# EAGLE design motherboard_rev0 (EAGLE 6.5.0)
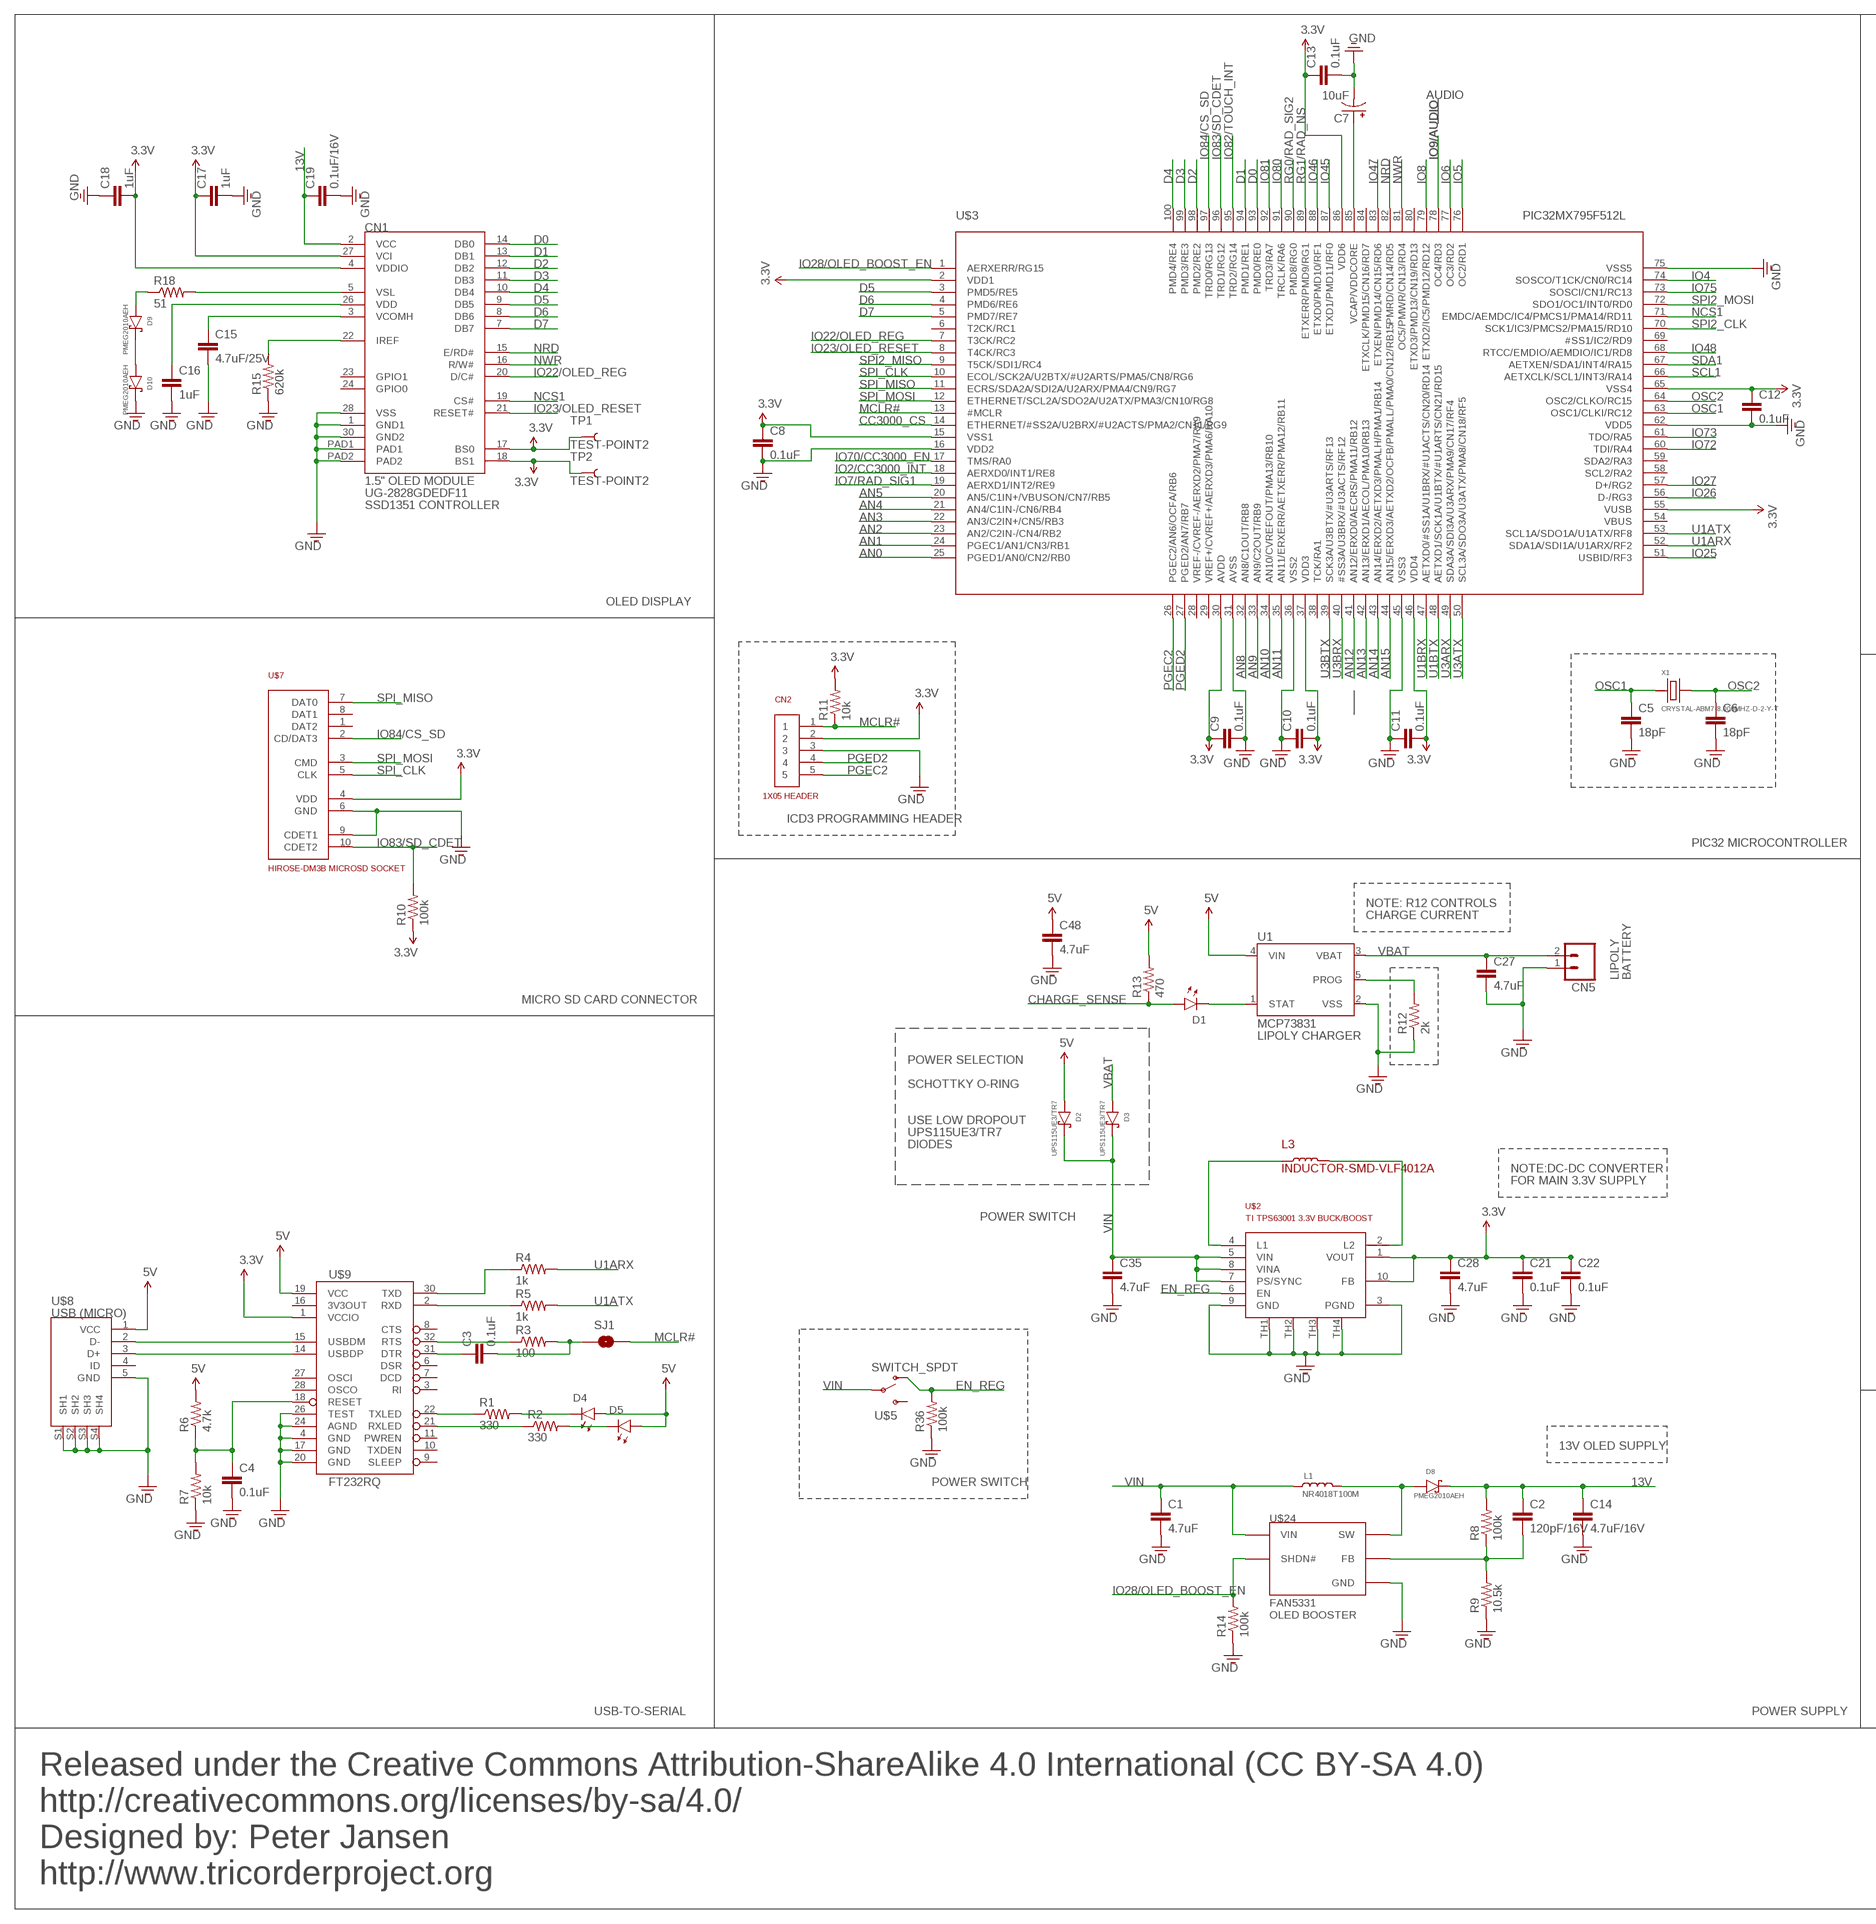
[diagram p0: schematic, sheet 1, part 1 of 2]
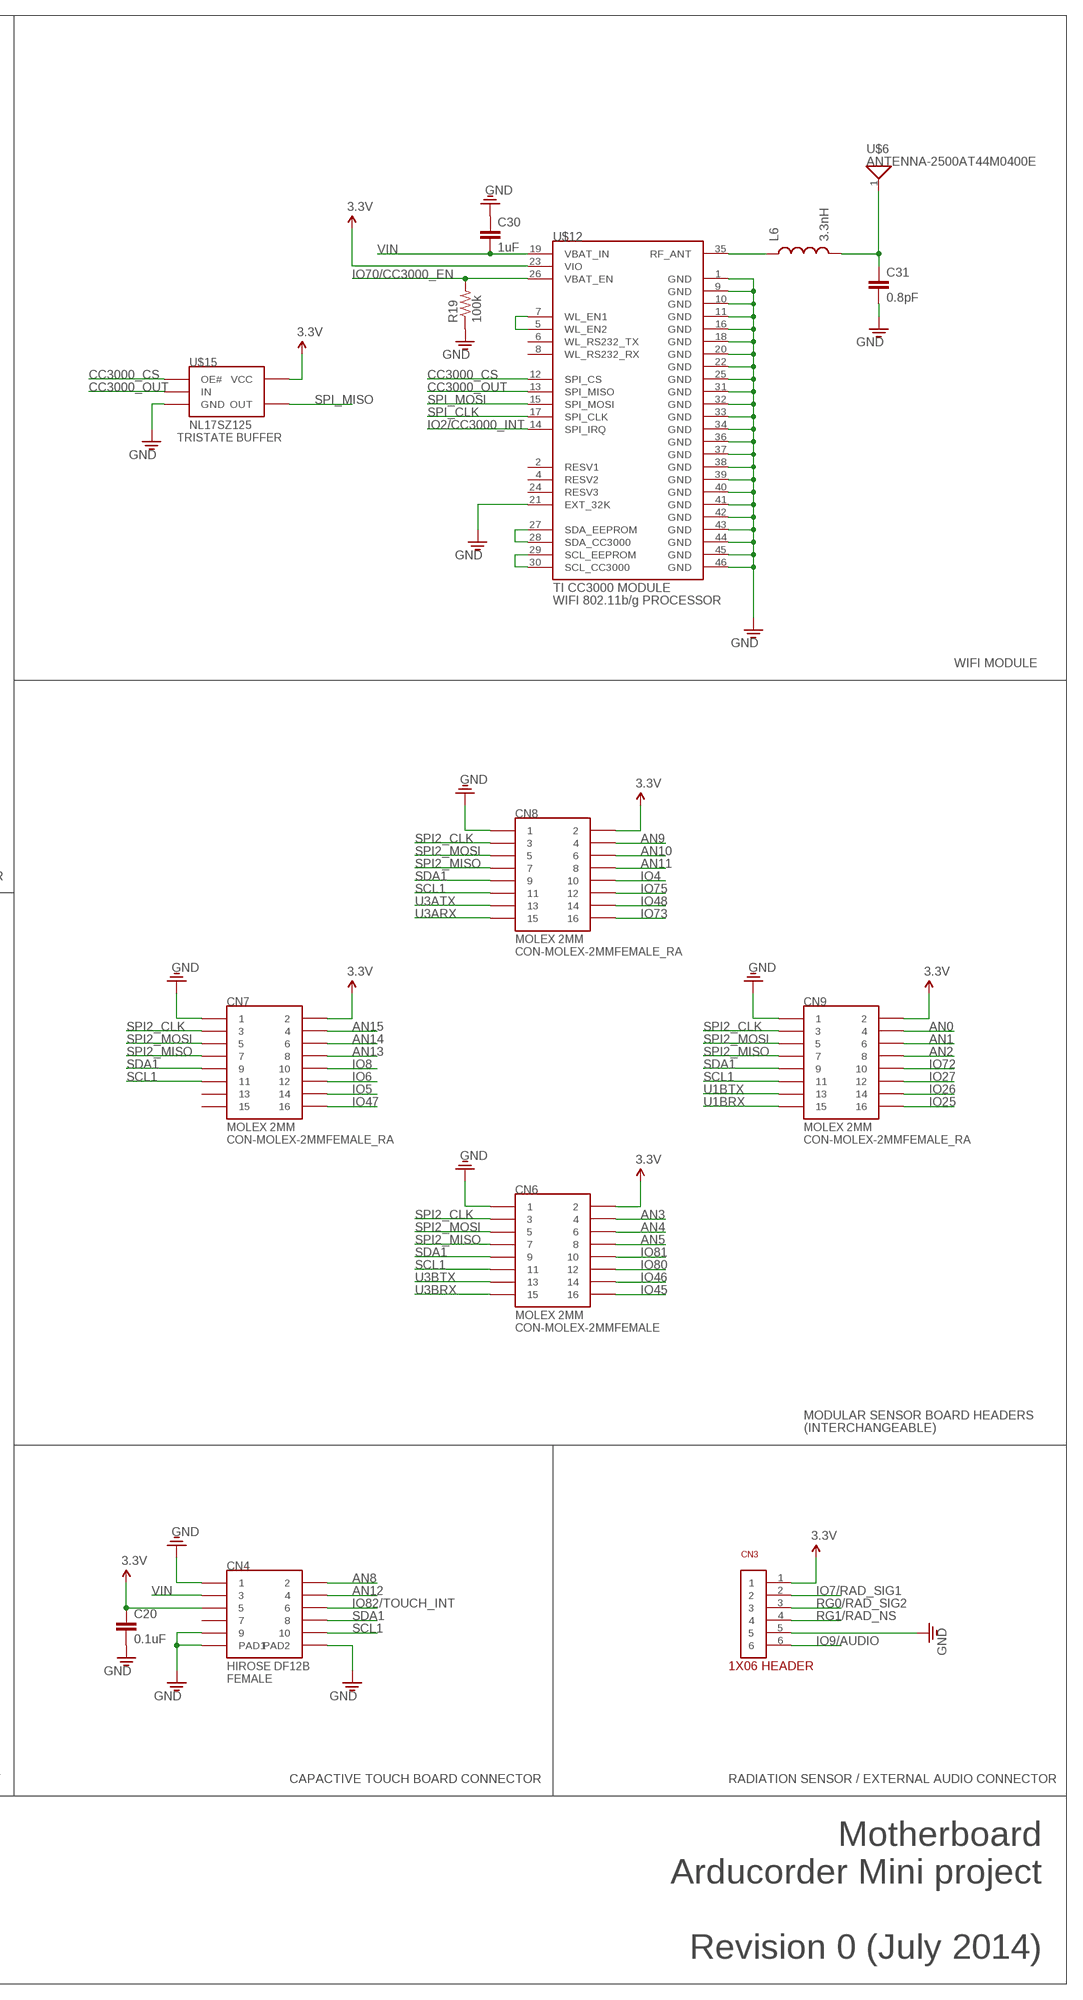
[diagram p1: schematic, sheet 1, part 2 of 2]

## Parts
C1  4.7uF  CAP0603  [0603]
C2  120pF/16V  CAP0603  [0603]
C3  0.1uF  CAP0603  [0603]
C4  0.1uF  CAP0603  [0603]
C5  18pF  CAP0603  [0603]
C6  18pF  CAP0603  [0603]
C7  10uF  CAP_POL1206  [EIA3216]
C8  0.1uF  CAP0603  [0603]
C9  0.1uF  CAP0603  [0603]
C10  0.1uF  CAP0603  [0603]
C11  0.1uF  CAP0603  [0603]
C12  0.1uF  CAP0603  [0603]
C13  0.1uF  CAP0603  [0603]
C14  4.7uF/16V  CAP0603  [0603]
C15  4.7uF/25V  CAP0603  [0603]
C16  1uF  CAP0603  [0603]
C17  1uF  CAP0603  [0603]
C18  1uF  CAP0603  [0603]
C19  0.1uF/16V  CAP0603  [0603]
C20  0.1uF  CAP0603  [0603]
C21  0.1uF  CAP0603  [0603]
C22  0.1uF  CAP0603  [0603]
C27  4.7uF  CAP0603  [0603]
C28  4.7uF  CAP0603  [0603]
C30  1uF  CAP0603  [0603]
C31  0.8pF  CAP0402  [C0402]
C35  4.7uF  CAP0603  [0603]
C48  4.7uF  CAP0603  [0603]
CN1  UG-2828GDEDF11-1.5OLED  [XF2M-3015-1A-1.5LCD]
CN2  1X05  [1X05]
CN3  1X06  [1X06]
CN4  FEMALE  CON-HIROSE-DF12FEMALE  [DF12B(3.0)-10DP-0.5V(86)]
CN5  M02-JST-2MM-SMT  [JST-2-SMD]
CN6  CON-MOLEX-2MMFEMALE  [MOLEX-0791091007]
CN7  CON-MOLEX-2MMFEMALE_RA  [MOLEX-87368-1624]
CN8  CON-MOLEX-2MMFEMALE_RA  [MOLEX-87368-1624]
CN9  CON-MOLEX-2MMFEMALE_RA  [MOLEX-87368-1624]
D1  0605-LED  [0603-LED]
D2  UPS115UE3/TR7  DIODE-SCHOTTKY  [DO-214BA]
D3  UPS115UE3/TR7  DIODE-SCHOTTKY  [DO-214BA]
D4  0605-LED  [0603-LED]
D5  0605-LED  [0603-LED]
D8  PMEG2010AEH  DIODE-SCHOTTKYSOD123F  [SOD123F]
D9  PMEG2010AEH  DIODE-SCHOTTKYSOD123F  [SOD123F]
D10  PMEG2010AEH  DIODE-SCHOTTKYSOD123F  [SOD123F]
L1  NR4018T100M  INDUCTORNR4018T100M  [NR4018T100M]
L3  INDUCTOR-SMD-VLF4012A  [VLF4012A]
L6  3.3nH  INDUCTOR0402  [C0402]
R1  330  RESISTOR0603  [0603]
R2  330  RESISTOR0603  [0603]
R3  100  RESISTOR0603  [0603]
R4  1k  RESISTOR0603  [0603]
R5  1k  RESISTOR0603  [0603]
R6  4.7k  RESISTOR0603  [0603]
R7  10k  RESISTOR0603  [0603]
R8  100k  RESISTOR0603  [0603]
R9  10.5k  RESISTOR0603  [0603]
R10  100k  RESISTOR0603  [0603]
R11  10k  RESISTOR0603  [0603]
R12  2k  RESISTOR0603  [0603]
R13  470  RESISTOR0603  [0603]
R14  100k  RESISTOR0603  [0603]
R15  620k  RESISTOR0603  [0603]
R18  51  RESISTOR0603  [0603]
R19  100k  RESISTOR0603  [0603]
R36  100k  RESISTOR0603  [0603]
SJ1  SOLDERJUMPERTRACE  [SJ_2S-TRACE]
TP1  TEST-POINT2  [PAD.02X.02]
TP2  TEST-POINT2  [PAD.02X.02]
U1  MCP73831  [SOT23-5]
U$2  TI-TPS63001-3.3V-BUCKBOOST  [TPS63001]
U$3  PIC32MX795F512L-80I/PF  [SQFP-S-14X14-100]
U$5  SWITCH_SPDT  [KPS-1290]
U$6  ANTENNA-2500AT44M0400E  [ANT-2500AT44M0400E]
U$7  CON-HIROSE-DM3B-MICROSD  [CON-HIROSE-DM3B-MICROSD]
U$8  USB-MICROB  [FCI-10104110-0001LF]
U$9  FT232RQ  [QFN-32]
U$12  CC3000  [CC3000]
U$15  BUFFER-NL17SZ125  [TSOP-5]
U$24  FAN5331-BOOST  [TSOP-5]
X1  CRYSTAL-ABM7-8.000MHZ-D-2-Y-T  [CYRSTAL-6.0X3.5MM]

## Nets
3.3V: C8.1 C9.1 C10.2 C11.2 C12.1 C13.1 C17.1 C18.2 C20.1 C21.1 C22.1 C28.1 CN1.4(VDDIO) CN1.17(BS0) CN1.18(BS1) CN1.27(VCI) CN2.2 CN3.1 CN4.5 CN6.2 CN7.2 CN8.2 CN9.2 R10.1 R11.2 TP1.P$1 TP2.P$1 U$2.1(VOUT) U$2.10(FB) U$3.2(VDD1) U$3.15(VSS1) U$3.30(AVDD) U$3.37(VDD3) U$3.46(VDD4) U$3.55(VUSB) U$3.65(VSS4) U$3.86(VDD6) U$7.4(VDD) U$9.1(VCCIO) U$12.23(VIO) U$15.5(VCC)
5V: C48.1 D2.ANODE D4.ANODE D5.ANODE R6.2 R13.2 U1.4(VIN) U$8.1(VCC) U$9.19(VCC)
13V: C2.1 C14.1 C19.1 CN1.2(VCC) D8.1(CATHODE) R8.2
AN0: CN9.4 U$3.25(PGED1/AN0/CN2/RB0)
AN1: CN9.6 U$3.24(PGEC1/AN1/CN3/RB1)
AN2: CN9.8 U$3.23(AN2/C2IN-/CN4/RB2)
AN3: CN6.4 U$3.22(AN3/C2IN+/CN5/RB3)
AN4: CN6.6 U$3.21(AN4/C1IN-/CN6/RB4)
AN5: CN6.8 U$3.20(AN5/C1IN+/VBUSON/CN7/RB5)
AN8: CN4.2 U$3.32(AN8/C1OUT/RB8)
AN9: CN8.4 U$3.33(AN9/C2OUT/RB9)
AN10: CN8.6 U$3.34(AN10/CVREFOUT/PMA13/RB10)
AN11: CN8.8 U$3.35(AN11/ERXERR/AETXERR/PMA12/RB11)
AN12: CN4.4 U$3.41(AN12/ERXD0/AECRS/PMA11/RB12)
AN13: CN7.8 U$3.42(AN13/ERXD1/AECOL/PMA10/RB13)
AN14: CN7.6 U$3.43(AN14/ERXD2/AETXD3/PMALH/PMA1/RB14)
AN15: CN7.4 U$3.44(AN15/ERXD3/AETXD2/OCFB/PMALL/PMA0/CN12/RB15)
CC3000_CS: U$3.14(ETHERNET/#SS2A/U2BRX/#U2ACTS/PMA2/CN11/RG9) U$12.12(SPI_CS) U$15.1(OE#)
CC3000_OUT: U$12.13(SPI_MISO) U$15.2(IN)
CHARGE_SENSE: D1.ANODE R13.1
D0: CN1.14(DB0) U$3.93(PMD0/RE0)
D1: CN1.13(DB1) U$3.94(PMD1/RE1)
D2: CN1.12(DB2) U$3.98(PMD2/RE2)
D3: CN1.11(DB3) U$3.99(PMD3/RE3)
D4: CN1.10(DB4) U$3.100(PMD4/RE4)
D5: CN1.9(DB5) U$3.3(PMD5/RE5)
D6: CN1.8(DB6) U$3.4(PMD6/RE6)
D7: CN1.7(DB7) U$3.5(PMD7/RE7)
EN_REG: R36.2 U$2.6(EN) U$5.O
GND: C1.2 C4.2 C5.2 C6.2 C7.C(-) C8.2 C9.2 C10.1 C11.1 C12.2 C13.2 C14.2 C15.2 C16.2 C17.2 C18.1 C19.2 C20.2 C21.2 C22.2 C27.2 C28.2 C30.1 C31.2 C35.2 C48.2 CN1.1(GND1) CN1.28(VSS) CN1.30(GND2) CN1.PAD1 CN1.PAD2 CN2.3 CN3.5 CN4.1 CN4.9 CN4.PAD1 CN4.PAD2 CN5.1 CN6.1 CN7.1 CN8.1 CN9.1 D10.1(CATHODE) R7.1 R9.1 R12.1 R14.1 R15.1 R19.1 R36.1 U1.2(VSS) U$2.3(PGND) U$2.9(GND) U$2.TH1(THERM1) U$2.TH2(THERM2) U$2.TH3(THERM3) U$2.TH4(THERM4) U$3.16(VDD2) U$3.31(AVSS) U$3.36(VSS2) U$3.45(VSS3) U$3.62(VDD5) U$3.75(VSS5) U$7.6(GND) U$7.9(CDET1) U$8.5(GND) U$8.S1(SH1) U$8.S2(SH2) U$8.S3(SH3) U$8.S4(SH4) U$9.4(GND) U$9.17(GND) U$9.20(GND) U$9.24(AGND) U$9.26(TEST) U$12.1(GND) U$12.9(GND) U$12.10(GND) U$12.11(GND) U$12.16(GND) U$12.18(GND) U$12.20(GND) U$12.21(EXT_32K) U$12.22(GND) U$12.25(GND) U$12.31(GND) U$12.32(GND) U$12.33(GND) U$12.34(GND) U$12.36(GND) U$12.37(GND) U$12.38(GND) U$12.39(GND) U$12.40(GND) U$12.41(GND) U$12.42(GND) U$12.43(GND) U$12.44(GND) U$12.45(GND) U$12.46(GND) U$15.3(GND) U$24.2(GND)
IO2/CC3000_INT: U$3.18(AERXD0/INT1/RE8) U$12.14(SPI_IRQ)
IO4: CN8.10 U$3.74(SOSCO/T1CK/CN0/RC14)
IO5: CN7.14 U$3.76(OC2/RD1)
IO6: CN7.12 U$3.77(OC3/RD2)
IO7/RAD_SIG1: CN3.2 U$3.19(AERXD1/INT2/RE9)
IO8: CN7.10 U$3.79(ETXD2/IC5/PMD12/RD12)
IO9/AUDIO: CN3.6 U$3.78(OC4/RD3)
IO22/OLED_REG: CN1.20(D/C#) U$3.7(T3CK/RC2)
IO23/OLED_RESET: CN1.21(RESET#) U$3.8(T4CK/RC3)
IO25: CN9.16 U$3.51(USBID/RF3)
IO26: CN9.14 U$3.56(D-/RG3)
IO27: CN9.12 U$3.57(D+/RG2)
IO28/OLED_BOOST_EN: R14.2 U$3.1(AERXERR/RG15) U$24.4(SHDN#)
IO45: CN6.16 U$3.87(ETXD1/PMD11/RF0)
IO46: CN6.14 U$3.88(ETXD0/PMD10/RF1)
IO47: CN7.16 U$3.83(ETXEN/PMD14/CN15/RD6)
IO48: CN8.14 U$3.68(RTCC/EMDIO/AEMDIO/IC1/RD8)
IO70/CC3000_EN: R19.2 U$3.17(TMS/RA0) U$12.26(VBAT_EN)
IO72: CN9.10 U$3.60(TDI/RA4)
IO73: CN8.16 U$3.61(TDO/RA5)
IO75: CN8.12 U$3.73(SOSCI/CN1/RC13)
IO80: CN6.12 U$3.91(TRCLK/RA6)
IO81: CN6.10 U$3.92(TRD3/RA7)
IO82/TOUCH_INT: CN4.6 U$3.95(TRD2/RG14)
IO83/SD_CDET: R10.2 U$3.96(TRD1/RG12) U$7.10(CDET2)
IO84/CS_SD: U$3.97(TRD0/RG13) U$7.2(CD/DAT3)
MCLR#: CN2.1 R11.1 SJ1.2 U$3.13(#MCLR)
N$1: L3.1 U$2.4(L1)
N$2: L3.2 U$2.2(L2)
N$3: U$8.2(D-) U$9.15(USBDM)
N$4: U$8.3(D+) U$9.14(USBDP)
N$5: R1.1 U$9.22(TXLED)
N$6: R2.1 U$9.21(RXLED)
N$7: D4.CATHODE R1.2
N$8: D5.CATHODE R2.2
N$9: C3.1 U$9.31(DTR)
N$10: R3.1 U$9.32(RTS)
N$11: C3.2 R3.2 SJ1.1
N$12: C4.1 R6.1 R7.2 U$9.18(RESET)
N$13: R5.1 U$9.2(RXD)
N$14: C31.1 L6.2 U$6.1
N$15: R4.1 U$9.30(TXD)
N$16: U$12.27(SDA_EEPROM) U$12.28(SDA_CC3000)
N$18: L6.1 U$12.35(RF_ANT)
N$19: C7.A(+) U$3.85(VCAP/VDDCORE)
N$20: C15.1 CN1.3(VCOMH)
N$21: D8.2(ANODE) L1.1 U$24.1(SW)
N$22: CN1.22(IREF) R15.2
N$23: C2.2 R8.1 R9.2 U$24.3(FB)
N$24: C16.1 CN1.26(VDD)
N$25: D9.1(CATHODE) D10.2(ANODE)
N$26: D9.2(ANODE) R18.1
N$27: R12.2 U1.5(PROG)
N$28: U$12.29(SCL_EEPROM) U$12.30(SCL_CC3000)
N$29: CN1.5(VSL) R18.2
N$32: D1.CATHODE U1.1(STAT)
N$33: U$12.5(WL_EN2) U$12.7(WL_EN1)
NCS1: CN1.19(CS#) U$3.71(EMDC/AEMDC/IC4/PMCS1/PMA14/RD11)
NRD: CN1.15(E/RD#) U$3.82(PMRD/CN14/RD5)
NWR: CN1.16(R/W#) U$3.81(OC5/PMWR/CN13/RD4)
OSC1: C5.1 U$3.63(OSC1/CLKI/RC12) X1.1
OSC2: C6.1 U$3.64(OSC2/CLKO/RC15) X1.2
PGEC2: CN2.5 U$3.26(PGEC2/AN6/OCFA/RB6)
PGED2: CN2.4 U$3.27(PGED2/AN7/RB7)
RG0/RAD_SIG2: CN3.3 U$3.90(PMD8/RG0)
RG1/RAD_NS: CN3.4 U$3.89(ETXERR/PMD9/RG1)
SCL1: CN4.10 CN6.11 CN7.11 CN8.11 CN9.11 U$3.66(AETXCLK/SCL1/INT3/RA14)
SDA1: CN4.8 CN6.9 CN7.9 CN8.9 CN9.9 U$3.67(AETXEN/SDA1/INT4/RA15)
SPI2_CLK: CN6.3 CN7.3 CN8.3 CN9.3 U$3.70(SCK1/IC3/PMCS2/PMA15/RD10)
SPI2_MISO: CN6.7 CN7.7 CN8.7 CN9.7 U$3.9(T5CK/SDI1/RC4)
SPI2_MOSI: CN6.5 CN7.5 CN8.5 CN9.5 U$3.72(SDO1/OC1/INT0/RD0)
SPI_CLK: U$3.10(ECOL/SCK2A/U2BTX/#U2ARTS/PMA5/CN8/RG6) U$7.5(CLK) U$12.17(SPI_CLK)
SPI_MISO: U$3.11(ECRS/SDA2A/SDI2A/U2ARX/PMA4/CN9/RG7) U$7.7(DAT0) U$15.4(OUT)
SPI_MOSI: U$3.12(ETHERNET/SCL2A/SDO2A/U2ATX/PMA3/CN10/RG8) U$7.3(CMD) U$12.15(SPI_MOSI)
U1ARX: R4.2 U$3.52(SDA1A/SDI1A/U1ARX/RF2)
U1ATX: R5.2 U$3.53(SCL1A/SDO1A/U1ATX/RF8)
U1BRX: CN9.15 U$3.47(AETXD0/#SS1A/U1BRX/#U1ACTS/CN20/RD14)
U1BTX: CN9.13 U$3.48(AETXD1/SCK1A/U1BTX/#U1ARTS/CN21/RD15)
U3ARX: CN8.15 U$3.49(SDA3A/SDI3A/U3ARX/PMA9/CN17/RF4)
U3ATX: CN8.13 U$3.50(SCL3A/SDO3A/U3ATX/PMA8/CN18/RF5)
U3BRX: CN6.15 U$3.40(#SS3A/U3BRX/#U3ACTS/RF12)
U3BTX: CN6.13 U$3.39(SCK3A/U3BTX/#U3ARTS/RF13)
VBAT: C27.1 CN5.2 D3.ANODE U1.3(VBAT)
VIN: C1.1 C30.2 C35.1 CN4.3 D2.CATHODE D3.CATHODE L1.2 U$2.5(VIN) U$2.7(PS/SYNC) U$2.8(VINA) U$5.P U$12.19(VBAT_IN) U$24.5(VIN)
Unconnected: CN1.23(GPIO1) CN1.24(GPIO0) CN4.7 CN7.13 CN7.15 U$3.6(T2CK/RC1) U$3.28(VREF-/CVREF-/AERXD2/PMA7/RA9) U$3.29(VREF+/CVREF+/AERXD3/PMA6/RA10) U$3.38(TCK/RA1) U$3.54(VBUS) U$3.58(SCL2/RA2) U$3.59(SDA2/RA3) U$3.69(#SS1/IC2/RD9) U$3.80(ETXD3/PMD13/CN19/RD13) U$3.84(ETXCLK/PMD15/CN16/RD7) U$5.S U$7.1(DAT2) U$7.8(DAT1) U$8.4(ID) U$9.3(RI) U$9.6(DSR) U$9.7(DCD) U$9.8(CTS) U$9.9(SLEEP) U$9.10(TXDEN) U$9.11(PWREN) U$9.16(3V3OUT) U$9.27(OSCI) U$9.28(OSCO) U$12.2(RESV1) U$12.4(RESV2) U$12.6(WL_RS232_TX) U$12.8(WL_RS232_RX) U$12.24(RESV3)

## Notes on the sheet
- AUDIO
- OLED DISPLAY
- WIFI MODULE
- ICD3 PROGRAMMING HEADER
- PIC32 MICROCONTROLLER
- NOTE: R12 CONTROLS
- CHARGE CURRENT
- LIPOLY | BATTERY
- MICRO SD CARD CONNECTOR
- LIPOLY CHARGER
- POWER SELECTION
- SCHOTTKY O-RING
- USE LOW DROPOUT
- UPS115UE3/TR7
- DIODES
- NOTE:DC-DC CONVERTER
- FOR MAIN 3.3V SUPPLY
- POWER SWITCH
- MODULAR SENSOR BOARD HEADERS
- (INTERCHANGEABLE)
- 13V OLED SUPPLY
- POWER SWITCH
- USB-TO-SERIAL | POWER SUPPLY | CAPACTIVE TOUCH BOARD CONNECTOR | RADIATION SENSOR / EXTERNAL AUDIO CONNECTOR
- Motherboard
- Released under the Creative Commons Attribution-ShareAlike 4.0 International (CC BY-SA 4.0)
- Arducorder Mini project
- http://creativecommons.org/licenses/by-sa/4.0/
- Designed by: Peter Jansen
- Revision 0 (July 2014)
- http://www.tricorderproject.org

## Library data of the parts
C1 C3-C6 C8-C22 C27 C28 C30 C31 C35 C48 = notes_mark5a:CAP: Capacitor Standard 0603 ceramic capacitor, and 0.1" leaded capacitor.
C2 = notes_mark5a1:CAP: Capacitor Standard 0603 ceramic capacitor, and 0.1" leaded capacitor.
C7 = SparkFun-Passives:CAP_POL: Capacitor Polarized These are standard SMD and PTH capacitors. Normally 10uF, 47uF, and 100uF in electrolytic and tantalum varieties. Always verify the external diameter of the through hole cap, it varies with capacity, voltage, and manufacturer. The EIA devices should be standard.
CN1 = notes-arducorder-mini:UG-2828GDEDF11-1.5OLED: OLED display, 1.5", 128x128, 16bpp. Model #ER-OLED015 or UG-2828GDEDF11
CN2 = notes_mark5a:1X05
CN3 = arm1a:1X06
CN4 = notes-arducorder-mini:CON-HIROSE-DF12
CN5 = SparkFun-Connectors:M02: Header 2 Standard 2-pin 0.1" header. Use with straight break away headers (SKU : PRT-00116), right angle break away headers (PRT-00553), swiss pins (PRT-00743), machine pins (PRT-00117), and female headers (PRT-00115). Molex polarized connector foot print use with SKU : PRT-08233 with associated crimp pins and housings.
CN6-CN9 = notes-arducorder-mini:CON-MOLEX-2MM: Molex 2mm pitch connectors. (87368-1624, 0877591650)
D1 D4 D5 = notes_mark5a:0605-LED
D2 D3 = notes_mark5a:DIODE-SCHOTTKY
D8-D10 = notes-arducorder-mini:DIODE-SCHOTTKY
L1 = notes-arducorder-mini:INDUCTOR
L3 = notes_mark5a:INDUCTOR-SMD-VLF4012A
L6 = SparkFun-Passives:INDUCTOR: Inductors Basic Inductor/Choke - 0603 and 1206. Footprints are not proven and vary greatly between part numbers.
R1-R7 R10-R13 R36 = notes_mark5a:RESISTOR: Resistor Basic schematic elements and footprints for 0603, 1206, and PTH 1/10th watt (small) resistors.
R8 R9 R14 R15 R18 R19 = notes_mark5a1:RESISTOR: Resistor Basic schematic elements and footprints for 0603, 1206, and PTH 1/10th watt (small) resistors.
SJ1 = SparkFun-Passives:SOLDERJUMPER: Solder Jumper Standard SMD solder jumper. Used to automate production. Two varients : Normally Open and Normally Closed are the same, but have different paste layers. NC will have a large amount of paste and should jumper during reflow.
TP1 TP2 = SparkFun-Passives:TEST-POINT: Bare copper test points for troubleshooting or ICT
U1 = SparkFun-PowerIC:MCP73831: Miniature single cell, fully integrated Li-Ion, Li-polymer charge management controller http://ww1.microchip.com/downloads/en/DeviceDoc/21984a.pdf
U$2 = notes_mark5a:TI-TPS63001-3.3V-BUCKBOOST: Texas Instruments TPS63001 3.3V Buck/Boost DC-DC Converter. High efficiency, single inductor.
U$3 = notes_mark5:PIC32MX795F512L-80I/PF
U$5 = SparkFun-Electromechanical:SWITCH_SPDT: Side-actuated SPDT slide switch, as used on the Arduino Pro
U$6 = notes_mark5a:ANTENNA-2500AT44M0400E: WiMAX 2.7Ghz Antenna #2500AT44M0400E by Johnson Technologies. For use with TI CC3000 Wifi Module.
U$7 = arm1a:CON-HIROSE-DM3B-MICROSD
U$8 = notes_mark5a:USB-MICROB: FCI USB Micro-B Socket (Part# 10104110-0001LF)
U$9 = SparkFun-DigitalIC:FT232RQ: USB to USART. Non-stock item, unproven FP for this part.
U$12 = notes_mark5a:CC3000: Texas Instruments SimpleLink CC3000 Module -- Wi-Fi 802.11b/g Network Processor
U$15 = notes-arducorder-mini:BUFFER-NL17SZ125: ON Semi NL17SZ125 Non-inverting 3-state buffer
U$24 = notes-arducorder-mini:FAN5331-BOOST: Fairchild FAN5331 High-efficiency OLED Supply
X1 = notes_mark5a:CRYSTAL-ABM7-8.000MHZ-D-2-Y-T

## Board
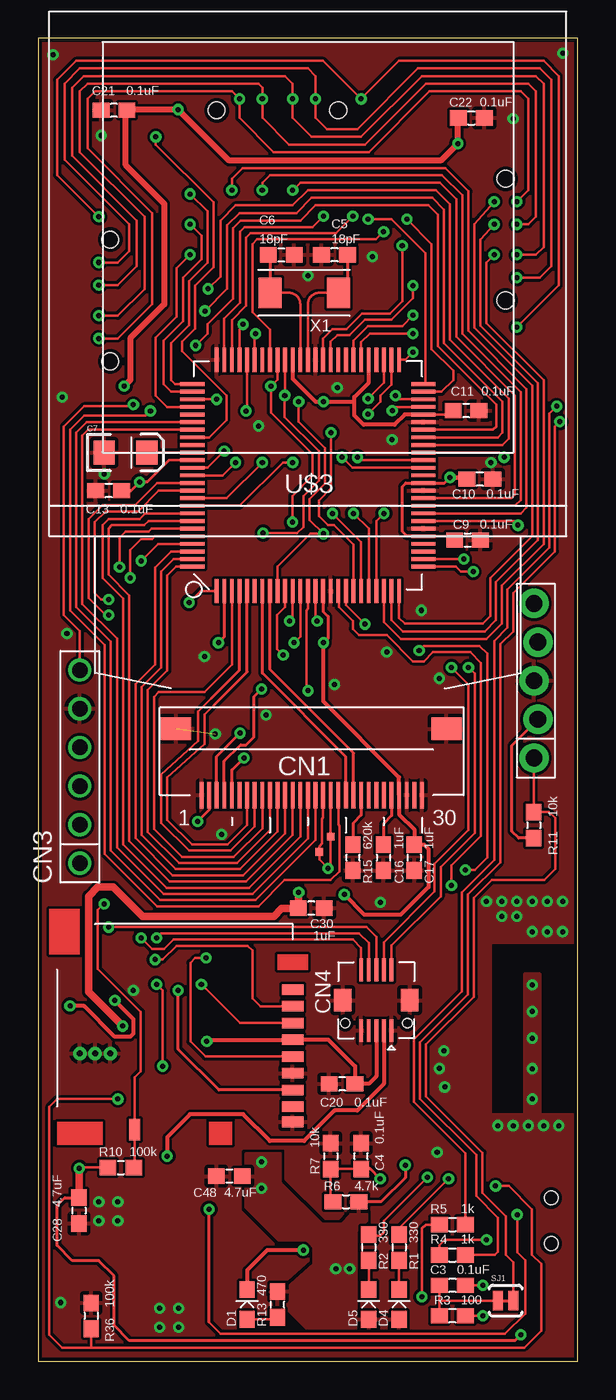
[diagram p2: board, top side]
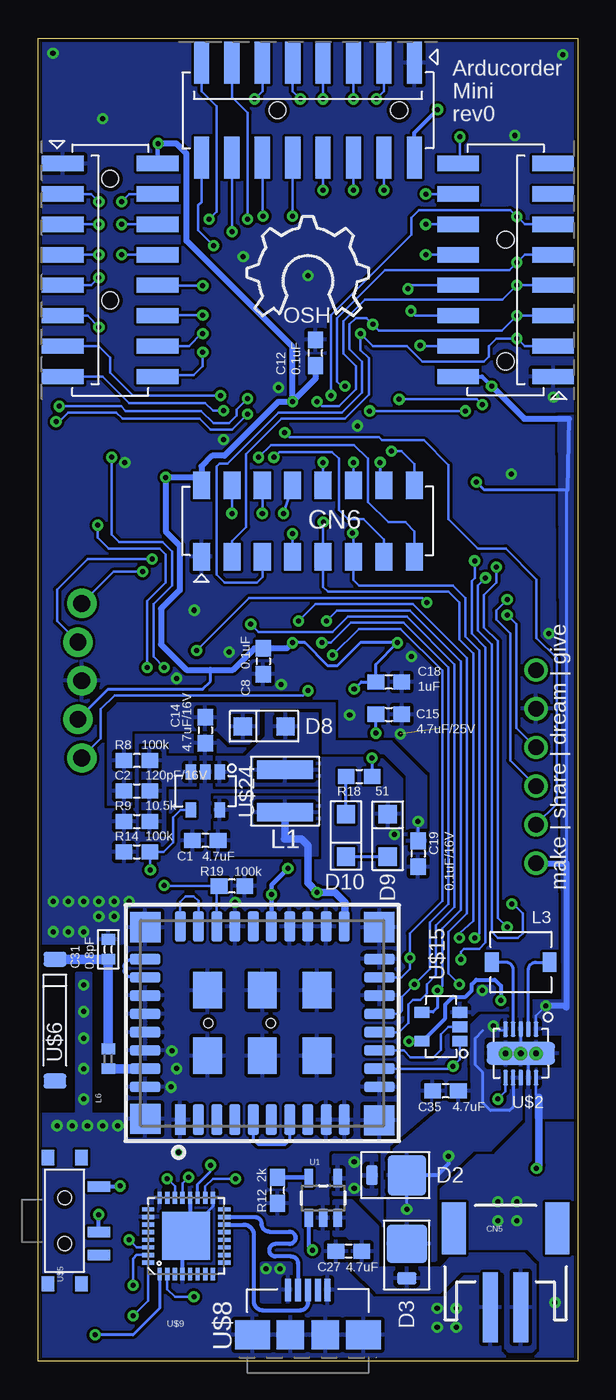
[diagram p3: board, bottom side, seen from below]

Size 35.5 x 87 mm. Coordinates in mm from the lower left corner, seen from the top.
Outline: 0,0 35.5,0 35.5,87 0,87 0,0
Copper layers (1*16): Top 0.035mm / dielectric 1.5mm / Bottom 0.035mm
Design rules "default *": minimum track width 7mil, minimum drill 13mil, track to track 7mil, track to pad 7mil, pad to pad 7mil, via to via 7mil, smd to smd 7mil, copper to edge 10mil, drill to drill 8mil, minimum pad ring 10mil, minimum via ring 8mil, stop-mask expansion 4mil, vias tented up to drill 0mil, thermal gap 10mil
tKeepout: area 1.2,15.8 to 16.8,28.8
bKeepout: area 0.8,11.2 to 8.8,17.2

### Footprints (pad centres in the part's own frame; a part is rotated, then mirrored left to right if it is on the bottom)
0603 = smd 1.1 x 1: 1 -0.85,0; 2 0.85,0
EIA3216 = smd 1.4 x 1.6: A 1.4,0; C -1.4,0
C0402 = smd 0.7 x 0.9: 1 -0.65,0; 2 0.65,0
XF2M-3015-1A-1.5LCD = smd 0.25 x 1.75: 1 -7,-3.02; 2 -6.5,-3.02; 3 -6,-3.02; 4 -5.5,-3.02; 5 -5,-3.02; 6 -4.5,-3.02; 7 -4,-3.02; 8 -3.5,-3.02; 9 -3,-3.02; 10 -2.5,-3.02; 11 -2,-3.02; 12 -1.5,-3.02; 13 -1,-3.02; 14 -0.5,-3.02; 15 0,-3.02; 16 0.5,-3.02; 17 1,-3.02; 18 1.5,-3.02; 19 2,-3.02; 20 2.5,-3.02; 21 3,-3.02; 22 3.5,-3.02; 23 4,-3.02; 24 4.5,-3.02; 25 5,-3.02; 26 5.5,-3.02; 27 6,-3.02; 28 6.5,-3.02; 29 7,-3.02; 30 7.5,-3.02 | smd 2 x 1.5: PAD1 9.11,1.34; PAD2 -8.68,1.35
1X05 = drill 1.1 pad 1.93: 1 -5.08,0.127; 2 -2.54,-0.127; 3 0,0.127; 4 2.54,-0.127; 5 5.08,0.127
1X06 = drill 1.016: 1 0,0; 2 2.54,0; 3 5.08,0; 4 7.62,0; 5 10.16,0; 6 12.7,0
DF12B(3.0)-10DP-0.5V(86) = smd 0.25 x 1.5: 1 -1,2; 2 -1,-2; 3 -0.5,2; 4 -0.5,-2; 5 0,2; 6 0,-2; 7 0.5,2; 8 0.5,-2; 9 1,2; 10 1,-2 | smd 1.15 x 1.5: PAD1 -2.2,0; PAD2 2.2,0 | hole 0.6: -2.05,1.5; 2.05,1.5
JST-2-SMD = smd 1 x 4.6: 1 -1,-3.7; 2 1,-3.7 | smd 1.6 x 3.4: NC1 -3.4,1.5; NC2 3.4,1.5
MOLEX-0791091007 = smd 1.12 x 1.83: 1 7,2.35; 2 7,-2.35; 3 5,2.35; 4 5,-2.35; 5 3,2.35; 6 3,-2.35; 7 1,2.35; 8 1,-2.35; 9 -1,2.35; 10 -1,-2.35; 11 -3,2.35; 12 -3,-2.35; 13 -5,2.35; 14 -5,-2.35; 15 -7,2.35; 16 -7,-2.35
MOLEX-87368-1624 = smd 1 x 2.75: 1 7,3.125; 2 7,-3.125; 3 5,3.125; 4 5,-3.125; 5 3,3.125; 6 3,-3.125; 7 1,3.125; 8 1,-3.125; 9 -1,3.125; 10 -1,-3.125; 11 -3,3.125; 12 -3,-3.125; 13 -5,3.125; 14 -5,-3.125; 15 -7,3.125; 16 -7,-3.125 | hole 1.1: -2,0; 6,0
0603-LED = smd 1.1 x 1: ANODE -0.975,0; CATHODE 0.975,0
DO-214BA = smd 0.762 x 1.27: ANODE 2.286,0 | smd 2.54 x 2.667: CATHODE 0,0
SOD123F = smd 1.2 x 1.2: 1 1.4,0; 2 -1.4,0
NR4018T100M = smd 1.2 x 3.7: 1 -1.4,0; 2 1.4,0
VLF4012A = smd 0.9 x 1.3: 1 -1.9,0; 2 1.9,0
SJ_2S-TRACE = smd 0.635 x 1.27: 1 -0.508,0; 2 0.508,0
PAD.02X.02 = smd 0.508 x 0.508: P$1 0,0
SOT23-5 = smd 0.55 x 1.2: 1 -0.95,-1.3; 2 0,-1.3; 3 0.95,-1.3; 4 0.95,1.3; 5 -0.95,1.3
TPS63001 = smd 0.3 x 1: 1 -1,-1.6; 2 -0.5,-1.6; 3 0,-1.6; 4 0.5,-1.6; 5 1,-1.6; 6 1,1.6; 7 0.5,1.6; 8 0,1.6; 9 -0.5,1.6; 10 -1,1.6 | drill 0.381: TH1 0,0; TH2 1,0; TH3 -1,0 | smd 4.5 x 1.5: TH4 0,0
SQFP-S-14X14-100 = smd 0.25 x 1.6: 1 -6,-7.6; 2 -5.5,-7.6; 3 -5,-7.6; 4 -4.5,-7.6; 5 -4,-7.6; 6 -3.5,-7.6; 7 -3,-7.6; 8 -2.5,-7.6; 9 -2,-7.6; 10 -1.5,-7.6; 11 -1,-7.6; 12 -0.5,-7.6; 13 0,-7.6; 14 0.5,-7.6; 15 1,-7.6; 16 1.5,-7.6; 17 2,-7.6; 18 2.5,-7.6; 19 3,-7.6; 20 3.5,-7.6; 21 4,-7.6; 22 4.5,-7.6; 23 5,-7.6; 24 5.5,-7.6; 25 6,-7.6; 51 6,7.6; 52 5.5,7.6; 53 5,7.6; 54 4.5,7.6; 55 4,7.6; 56 3.5,7.6; 57 3,7.6; 58 2.5,7.6; 59 2,7.6; 60 1.5,7.6; 61 1,7.6; 62 0.5,7.6; 63 0,7.6; 64 -0.5,7.6; 65 -1,7.6; 66 -1.5,7.6; 67 -2,7.6; 68 -2.5,7.6; 69 -3,7.6; 70 -3.5,7.6; 71 -4,7.6; 72 -4.5,7.6; 73 -5,7.6; 74 -5.5,7.6; 75 -6,7.6 | smd 1.6 x 0.25: 26 7.6,-6; 27 7.6,-5.5; 28 7.6,-5; 29 7.6,-4.5; 30 7.6,-4; 31 7.6,-3.5; 32 7.6,-3; 33 7.6,-2.5; 34 7.6,-2; 35 7.6,-1.5; 36 7.6,-1; 37 7.6,-0.5; 38 7.6,0; 39 7.6,0.5; 40 7.6,1; 41 7.6,1.5; 42 7.6,2; 43 7.6,2.5; 44 7.6,3; 45 7.6,3.5; 46 7.6,4; 47 7.6,4.5; 48 7.6,5; 49 7.6,5.5; 50 7.6,6; 76 -7.6,6; 77 -7.6,5.5; 78 -7.6,5; 79 -7.6,4.5; 80 -7.6,4; 81 -7.6,3.5; 82 -7.6,3; 83 -7.6,2.5; 84 -7.6,2; 85 -7.6,1.5; 86 -7.6,1; 87 -7.6,0.5; 88 -7.6,0; 89 -7.6,-0.5; 90 -7.6,-1; 91 -7.6,-1.5; 92 -7.6,-2; 93 -7.6,-2.5; 94 -7.6,-3; 95 -7.6,-3.5; 96 -7.6,-4; 97 -7.6,-4.5; 98 -7.6,-5; 99 -7.6,-5.5; 100 -7.6,-6
KPS-1290 = smd 0.7 x 1.5: O -2.25,2.25; P 0.75,2.25; S 2.25,2.25 | smd 1 x 0.8: P$1 -4.15,1.1; P$2 -4.15,-1.1; P$3 4.15,-1.1; P$4 4.15,1.1 | hole 0.9: -1.5,0; 1.5,0
ANT-2500AT44M0400E = smd 1 x 1.5: 1 4,0; 2 -4,0
CON-HIROSE-DM3B-MICROSD = smd 0.7 x 1.4: 1 -7.7,0; 2 -6.6,0; 3 -5.5,0; 4 -4.4,0; 5 -3.3,0; 6 -2.2,0; 7 -1.1,0; 8 0,0; 9 1,0 | smd 1.4 x 0.7: 10 1.5,-10.4
FCI-10104110-0001LF = smd 0.4 x 1.5: 1 -1.3,1.95; 2 -0.65,1.95; 3 0,1.95; 4 0.65,1.95; 5 1.3,1.95 | smd 2.3 x 1.9: S1 -3.65,-1; S4 3.65,-1 | smd 1.8 x 1.9: S2 -1.15,-1; S3 1.15,-1
QFN-32 = smd 0.285 x 0.8: 1 -1.75,-2.5; 2 -1.25,-2.5; 3 -0.75,-2.5; 4 -0.25,-2.5; 5 0.25,-2.5; 6 0.75,-2.5; 7 1.25,-2.5; 8 1.75,-2.5; 17 1.75,2.5; 18 1.25,2.5; 19 0.75,2.5; 20 0.25,2.5; 21 -0.25,2.5; 22 -0.75,2.5; 23 -1.25,2.5; 24 -1.75,2.5 | smd 0.8 x 0.285: 9 2.5,-1.75; 10 2.5,-1.25; 11 2.5,-0.75; 12 2.5,-0.25; 13 2.5,0.25; 14 2.5,0.75; 15 2.5,1.25; 16 2.5,1.75; 25 -2.5,1.75; 26 -2.5,1.25; 27 -2.5,0.75; 28 -2.5,0.25; 29 -2.5,-0.25; 30 -2.5,-0.75; 31 -2.5,-1.25; 32 -2.5,-1.75 | smd 3.15 x 3.15: EP 0,0
CC3000 = smd 2 x 0.7: 1 -6.35,5.4; 2 -6.35,4.2; 3 -6.35,3; 4 -6.35,1.8; 5 -6.35,0.6; 6 -6.35,-0.6; 7 -6.35,-1.8; 8 -6.35,-3; 9 -6.35,-4.2; 10 -6.35,-5.4; 19 6.35,-5.4; 20 6.35,-4.2; 21 6.35,-3; 22 6.35,-1.8; 23 6.35,-0.6; 24 6.35,0.6; 25 6.35,1.8; 26 6.35,3; 27 6.35,4.2; 28 6.35,5.4 | smd 0.7 x 2: 11 -4.2,-7.7; 12 -3,-7.7; 13 -1.8,-7.7; 14 -0.6,-7.7; 15 0.6,-7.7; 16 1.8,-7.7; 17 3,-7.7; 18 4.2,-7.7; 29 4.2,7.7; 30 3,7.7; 31 1.8,7.7; 32 0.6,7.7; 33 -0.6,7.7; 34 -1.8,7.7; 35 -3,7.7; 36 -4.2,7.7 | smd 2.4 x 1.9: 37 -2.15,3.6; 38 -2.15,0; 39 -2.15,-3.6; 40 2.15,3.6; 41 2.15,0; 42 2.15,-3.6 | smd 2 x 2: 43 -6.3,7.7; 44 -6.4,-7.7; 45 6.3,-7.7; 46 6.3,7.7
TSOP-5 = smd 0.7 x 1: 1 0.95,1.25; 2 0,1.25; 3 -0.95,1.25; 4 -0.95,-1.25; 5 0.95,-1.25
CYRSTAL-6.0X3.5MM = smd 1.5 x 2: 1 -2.25,0; 2 2.25,0

### Placement (x,y rotation side)
C1  24.5,34.25 180 bottom
C2  29,37.5 0 bottom
C3  27.25,5 180 top
C4  21.25,13.5 90 top
C5  19.5,72.75 180 top
C6  16,72.75 0 top
C7  5.75,59.75 0 top
C8  20.69,46.03 270 bottom
C9  28.25,54 0 top
C10  29.06,58 180 top
C11  28.15,62.5 180 top
C12  17.25,66.31 90 bottom
C13  4.65,57.25 180 top
C14  24.5,41.5 270 bottom
C15  12.43,42.54 0 bottom
C16  22.72,33.12 270 top
C17  24.74,33.12 270 top
C18  12.43,44.67 180 bottom
C19  10.5,33.38 270 bottom
C20  20,18.25 180 top
C21  5,82.25 180 top
C22  28.5,81.75 0 top
C27  15.06,7.25 180 bottom
C28  2.69,9.92 270 top
C30  17.97,29.8 180 top
C31  30.88,27.09 90 bottom
C35  8.7,17.79 180 bottom
C48  12.58,12.18 180 top
CN1  17.75,40.25 0 top
CN2  32.75,44.75 90 top
CN3  2.75,32.75 90 top
CN4  22.25,23.75 180 top
CN5  4.75,7.25 0 bottom
CN6  17.75,55.25 180 bottom
CN7  4.75,71.75 270 bottom
CN8  17.75,82.25 0 bottom
CN9  30.75,71.75 90 bottom
D1  13.75,3.75 90 top
D2  11.25,12.25 180 bottom
D3  11.25,7.75 270 bottom
D4  23.75,3.75 90 top
D5  21.75,3.75 90 top
D8  20.62,41.75 180 bottom
D9  15.25,34.58 270 bottom
D10  12.5,34.58 90 bottom
L1  19.25,37.5 270 bottom
L3  3.75,26.25 0 bottom
L6  30.88,19.9 90 bottom
R1  23.75,7.5 270 top
R2  21.75,7.5 270 top
R3  27.25,3 180 top
R4  27.25,7 0 top
R5  27.25,9 0 top
R6  20.25,10.5 0 top
R7  19.25,13.5 270 top
R8  29,39.5 180 bottom
R9  29,35.5 0 bottom
R10  5.45,12.75 0 top
R11  32.6,35.25 270 top
R12  19.75,11.25 90 bottom
R13  15.75,3.75 90 top
R14  29,33.5 0 bottom
R15  20.72,33.12 90 top
R18  14.38,38.45 0 bottom
R19  22.75,31.25 180 bottom
R36  3.5,3 270 top
SJ1  30.75,4 0 top
TP1  18.5,33.5 0 top
TP2  19.25,34.5 0 top
U1  16.75,10.75 0 bottom
U$2  3.75,20.25 180 bottom
U$3  17.75,58.25 0 top
U$5  33.75,9.25 270 bottom
U$6  34.38,22.44 90 bottom
U$7  16.75,16.75 270 top
U$8  17.75,2.75 0 bottom
U$9  25.75,8.25 0 bottom
U$12  20.75,22.25 90 bottom
U$15  9,22 270 bottom
U$24  24.5,37.5 0 bottom
X1  17.5,70.25 180 top

### Tracks (layer width: path | path; a pad name or v marks a point on that pad's centre or on a via)
3.3V  (via drill 0.33)
  Top 0.178: CN1.17 18.75,35.75 18.67,35.66 18.67,34.04 18.5,33.87 TP1.P$1 18.5,32.99 v19.07,32.41 19.25,32.59 TP2.P$1 CN1.18 | U$3.86 8.62,59.25 | 5.41,57.25 C13.1 | U$3.46 27.4,62.25 C11.2 | U$3.30 27.4,54.25 C9.1 | R10.1 2.76,12.75 v2.72,12.7
  Top 0.203: CN1.4 12.25,39.46 13.33,40.54 13.7,40.54 14.2,41.05 14.2,43.7 v14.7,44.2 | v31.75,1.75 31.38,1.38 6,1.38 5,2.38 5,5.62 4,6.62 2.25,6.62 1.25,7.62 1.25,10.25 1.77,10.77 C28.1 | U$3.30 24.26,54.25 23.95,54.56 23.95,57.51 24.19,57.75 U$3.37 26.73,57.75 v27.1,58.12 | U$3.15 18.75,49.3 19.07,48.98 19.07,47.55 v18.77,47.25 | U$3.2 12.25,47.64 v11.86,47.25 | R11.2 31.62,34.4 31.16,34.85 31.16,40.5 CN2.2 | C13.1 6.11,57.25 v6.68,57.81 7.19,57.81 8.62,59.25
  Top 0.254: U$3.46 24.12,62.25 23.44,61.57 21.41,61.57 20.8,62.18 20.8,63.1 | 20.8,63.1 20.8,63.4 21.75,64.35 U$3.55 | v5.05,23.73 6.27,22.51 6.27,21.54 6.07,21.34 5.05,21.34 3.02,23.37 v2.11,23.37 | v11.1,21.04 11.21,21.15 U$7.4 19.1,21.15 20.85,19.4 C20.1 21.75,18.25 22.25,18.75 CN4.5 | v18.77,47.25 18.77,43.39 23.75,38.41 CN1.27 23.75,35.97 24.74,34.98 C17.1 25.39,33.98 25.68,33.68 25.68,31.2 23.85,29.37 21.46,29.37 v20.14,30.69 | 20.8,63.1 v18.77,63.1 18.26,63.1 16.75,64.61 U$3.65
  Top 0.305: v27.1,58.12 28.15,58.12 C10.2
  Top 0.406: v5.66,64.11 6.07,64.52 6.07,67.26 8.3,69.5 8.3,76.1 5.76,78.64 5.76,82.16 C21.1 5.9,82.3 v9.22,82.3 12.57,78.95 26.49,78.95 v27.61,80.06 27.61,81.71 C22.1
  Top 0.508: C28.1 2.72,10.79 v2.72,12.7
  Bottom 0.178: v2.72,12.7 2.75,12.74 | 2.56,17.38 2.75,17.56 U$2.10 | v2.11,23.37 2.75,22.73 U$2.1 | 11.08,21.05 v11.1,21.04
  Bottom 0.203: U$15.5 10.22,21.05 | U$9.1 27.5,3.5 29.25,1.75 v31.75,1.75 | v18.77,47.25 17.96,47.25 16.43,45.72 15.82,45.72 14.3,47.25 v11.86,47.25 13.28,45.83 C18.2 14.24,44.67 v14.7,44.2 | v6.68,57.81 6.17,57.31 0.68,57.31 0.75,57.24 0.75,32.75 | CN2.2 30.89,44.2 24.66,44.2 24.15,44.71 24.15,45.47 | 20.15,31.34 20.14,31.33 v20.14,30.69
  Bottom 0.254: 10.22,21.05 8.71,22.56 8.71,23.47 8.2,23.98 7.39,23.98 6.98,24.39 6.98,24.79 6.68,25.1 5.46,25.1 5.05,24.69 v5.05,23.73 | U$15.5 11.08,21.05 | CN7.2 6.3,64.75 v5.66,64.11 | 0.58,61.98 0.68,57.31 | CN8.2 10.75,80.77 v9.22,82.3 | 27.62,80.05 v27.61,80.06
  Bottom 0.305: CN9.2 27.62,80.05 | v19.07,32.41 20.15,31.34 U$12.23
  Bottom 0.406: CN3.1 0.75,32.75 0.75,23.25 0.87,23.37 v2.11,23.37 | v18.77,47.25 19.14,46.88 C8.1 21.27,46.88 22.68,45.47 24.15,45.47 25.73,45.47 27.4,47.15 27.4,49.48 26.19,50.7 26.19,53.65 27.1,54.56 v27.1,58.12 24.75,58.12 | v5.66,64.11 3.53,61.98 0.58,61.98 | CN6.2 24.75,58.12 | 24.75,58.12 24.75,58.84 24.05,59.54 23.24,59.54 19.68,63.1 v18.77,63.1 | v18.77,63.1 18.77,66.7 25.73,73.66 25.73,79.4 26.39,80.06 v27.61,80.06 | C12.1 17.25,64.62 v18.77,63.1
  Bottom 0.508: 2.75,12.74 2.56,12.93 2.56,17.38
  pour Bottom: 2.75,19.25 2.75,16 0.25,16 0.25,62.13 1.25,62.13 1,23.75 3,23.75 3,21.5 1,21.5 1,19.25
5V  (via drill 0.33)
  Top 0.203: v24.15,12.91 24.15,12.09 22.57,10.5 R6.2
  Bottom 0.203: U$9.19 25,11.65 24.15,12.5 v24.15,12.91
  other vias: 20.5,6.1 19.58,6.1 14.7,13.11 14.7,11.38
  pour Bottom: 18.87,6.4 20.8,6.4 20.8,3.97 18.87,3.97
  pour Bottom: 13.28,13.52 13.28,11.03 16.03,11.03 16.03,13.52
  pour Top: 24.15,2.83 21.26,2.83 20.9,3.19 20.9,8.58 21.61,9.29 21.61,10.76 20.6,10.76 20.6,9.59 19.99,8.98 18.67,8.98 15.92,11.73 15.92,13.62 13.69,13.62 13.69,10.16 15.82,8.03 17.65,8.03 18.16,7.52 18.16,6.34 16.13,4.56 15.31,4.56 15.31,3.65 16.23,3.65 18.06,1.82 24.15,1.82
13V  (via drill 0.33)
  Top 0.203: CN1.2 11.25,36.25 v10.5,35.5
  Bottom 0.203: v10.5,35.5 C19.1
  pour Bottom: 29.38,36.62 29.38,41.5 23.75,41.5 22.88,40.62 21.62,40.62 21,41.25 21,43 16.75,43 16.75,40 12.75,40 11.25,38.5 11.25,33.75 10,33.75 10,38.5 12.25,40.75 16,40.75 16,43.25 30.25,43.25 30.88,42.62 30.88,36.62
AN0  (via drill 0.33)
  Top 0.178: U$3.25 23.75,48.88 24.12,48.5 29.25,48.5 29.75,49 29.75,51.5 32.5,54.25 32.5,64.16 28.7,67.95 28.7,74.75 v30,76.25
  Bottom 0.178: v30,76.25 29.5,76.75 CN9.4
AN1  (via drill 0.33)
  Top 0.178: U$3.24 23.25,48.75 24,48 29.38,48 30.12,48.75 30.12,51.25 32.88,54 32.88,64.33 29.1,68.1 29.1,73.75 v30,74.75
  Bottom 0.178: v30,74.75 CN9.6
AN2  (via drill 0.33)
  Top 0.178: U$3.23 22.75,48.62 23.88,47.5 29.5,47.5 30.5,48.5 30.5,51 33.25,53.75 33.25,64.5 29.5,68.25 29.5,72.25 v30,72.75
  Bottom 0.178: v30,72.75 CN9.8
AN3  (via drill 0.33)
  Top 0.178: U$3.22 22.25,55.25 v22.75,55.75
  Bottom 0.178: v22.75,55.75 CN6.4
AN4  (via drill 0.33)
  Top 0.178: U$3.21 21.75,54.75 v20.75,55.75
  Bottom 0.178: v20.75,55.75 CN6.6
AN5  (via drill 0.33)
  Top 0.178: U$3.20 21.25,53.86 v19.36,55.75
  Bottom 0.178: v19.36,55.75 CN6.8
AN8  (via drill 0.33)
  Top 0.178: U$3.32 31.29,55.25 v31.57,54.97 | v28.32,45.62 28.72,45.22 28.72,34.75 26.49,32.52 26.49,30.59 23.25,27.34 CN4.2
  Bottom 0.178: v31.57,54.97 31.57,54.16 30.86,53.45 27.51,53.45 27.1,53.04 27.1,51.21 28.32,49.99 v28.32,45.62
AN9  (via drill 0.33)
  Top 0.178: U$3.33 31.75,55.75 32.12,56.12 32.12,63.93 28.31,67.75 28.31,76.93 26.8,78.44 13.44,78.44 12.75,77.75 v12.75,77
  Bottom 0.178: v12.75,77 CN8.4
AN10  (via drill 0.33)
  Top 0.178: U$3.34 31.38,56.25 31.75,56.62 31.75,63.71 27.91,67.56 27.91,76.66 26.57,78 15.25,78 14.75,77.5 v14.75,77
  Bottom 0.178: CN8.6 v14.75,77
AN11  (via drill 0.33)
  Top 0.178: U$3.35 31.12,56.75 31.38,57 31.38,63.49 27.51,67.36 27.51,76.41 26.42,77.5 17.25,77.5 v16.75,77
  Bottom 0.178: v16.75,77 CN8.8
AN12  (via drill 0.33)
  Top 0.178: U$3.41 30.34,59.75 v30.66,59.44 | v27.2,45.62 28.32,44.5 28.32,34.95 26.08,32.72 26.08,30.89 22.75,27.56 CN4.4
  Bottom 0.178: v30.66,59.44 30.66,54.36 30.15,53.85 27.3,53.85 26.69,53.24 26.69,51.01 27.91,49.79 27.91,46.33 v27.2,45.62
AN13  (via drill 0.33)
  Top 0.178: U$3.42 30.55,60.25 30.96,60.66 30.96,63.3 27.1,67.16 27.1,76.07 26.17,77 17.75,77 16.75,76 12.99,76 11.99,75 11.99,71.33 v11.18,70.52
  Bottom 0.178: CN7.8 10.94,70.75 v11.18,70.52
AN14  (via drill 0.33)
  Top 0.178: U$3.43 30.24,60.75 30.55,61.06 30.55,63.1 26.69,66.96 26.69,75.73 25.92,76.5 18,76.5 17,75.5 13.24,75.5 12.44,74.69 12.44,70.52 v10.98,69.06
  Bottom 0.178: CN7.6 10.66,68.75 v10.98,69.06
AN15  (via drill 0.33)
  Top 0.178: U$3.44 29.93,61.25 30.15,61.47 30.15,62.89 26.29,66.75 26.29,75.39 25.67,76 18.25,76 17.25,75 13.34,75 12.84,74.5 12.84,69.87 11.15,68.19 11.15,67.58 v10.37,66.8
  Bottom 0.178: CN7.4 10.32,66.75 v10.37,66.8
CC3000_CS  (via drill 0.33)
  Top 0.178: U$3.14 18.25,48.78 v18.36,48.67 | v8.2,19.41 8.2,24.39 v7.8,24.79
  Bottom 0.178: U$12.12 8.36,19.25 v8.2,19.41 7.75,19.86 U$15.1 | v18.36,48.67 17.24,49.79 10.84,49.79 7.29,46.23 7.29,29.47 8.51,28.25 8.51,25.51 v7.8,24.79
CC3000_OUT
  Bottom 0.178: U$12.13 11.45,20.45 11,20 9.5,20 9,20.5 9,21.5 8.5,22 U$15.2
CHARGE_SENSE
  Top 0.178: D1.ANODE 15.62,2.78 R13.1
D0
  Top 0.178: CN1.14 17.25,34.5 13.89,31.14 8.45,31.14 5.59,34 5.59,50.16 4.24,51.52 4.24,54.97 4.65,55.38 6.68,55.38 7.05,55.75 U$3.93
D1
  Top 0.178: CN1.13 16.75,34.61 13.69,31.55 8.66,31.55 6,34.2 6,50.36 4.65,51.72 4.65,54.77 4.85,54.97 6.98,54.97 7.26,55.25 U$3.94
D2
  Top 0.178: U$3.98 8.77,53.25 7.69,52.17 7.69,45.83 6.41,44.54 6.41,34.41 8.86,31.96 13.48,31.96 16.25,34.72 CN1.12
D3
  Top 0.178: U$3.99 8.93,52.75 8.1,51.92 8.1,45.62 6.81,44.34 6.81,34.61 9.06,32.36 13.28,32.36 15.75,34.83 CN1.11
D4
  Top 0.178: U$3.100 9.09,52.25 8.51,51.67 8.51,45.42 7.22,44.13 7.22,34.81 9.27,32.77 13.08,32.77 15.25,34.94 CN1.10
D5
  Top 0.178: U$3.3 12.75,45.8 10.95,44 7.94,44 7.63,43.68 7.63,35.02 9.47,33.18 12.88,33.18 14.75,35.05 CN1.9
D6
  Top 0.178: 11.4,43.59 10.53,42.73 10.53,40.78 8.1,38.6 8.1,35.4 9.92,33.58 12.67,33.58 14.25,35.16 CN1.8
  Top 0.203: 11.4,43.59 13.25,45.44 U$3.4
D7
  Top 0.178: 11.6,43.18 10.94,42.52 10.94,40.59 8.5,38.4 8.5,35.61 10.12,33.99 12.47,33.99 13.75,35.27 CN1.7
  Top 0.203: 11.6,43.18 13.75,45.33 U$3.5
EN_REG  (via drill 0.33)
  Top 0.178: v30.09,11.54 30.95,11.54 32.48,10.01 32.48,7.02 33.09,6.4 33.09,2.03 31.97,0.91 3.5,0.91 | 3.5,0.91 1.59,0.91 0.75,1.75 0.75,16.75 1.25,17.25 v5.25,17.25 | R36.2 3.5,0.91
  Bottom 0.178: v5.25,17.25 4.75,17.75 U$2.6
  Bottom 0.254: U$5.O 30.12,11.5 v30.09,11.54
GND  (via drill 0.33)  (1 unrouted)
  Bottom 0.178: U$2.9 3.25,19.75 U$2.TH3 | U$2.3 U$2.TH4
  Bottom 0.203: U$9.17 24,10.21 25.47,8.74 25.5,8.77
  Bottom 0.254: 26.01,5.77 26.01,8.26 25.5,8.77 U$9.20
  other vias: 8,3.5 9.25,3.5 9.25,2.25 8,2.25 4,10.5 5.25,10.5 4,9.25 5.25,9.25 26.69,20.43 26.39,19.26 26.74,18.04 29.5,30.25 30.5,30.25 31.5,30.25 32.5,30.25 33.5,30.25 34.5,30.25 30.25,15.5 31.25,15.5 32.25,15.5 33.25,15.5 34.25,15.5 22.53,30.18 12.06,34.65 11.66,41.25 10.95,46.33 25.22,49.38 29.79,59.08 4.37,58.33 6.27,24.39 17.75,71.38 19.68,64.01 0.99,85.91 34.52,86.01 31.25,81.69 4.15,80.6 1.5,3.88 19.51,44.51 22,72.62 22.93,46.64 1.6,63.4 1.9,47.86 23.29,60.61 26.39,44.91 32.5,17.25 32.5,19.25 32.5,21.25 32.5,23 32.5,24.75 34.5,28.25 33.5,28.25 32.5,28.25 31.5,29.25 30.5,29.25 14.5,61.5 15,42.5 26.25,13.75
  pour Bottom (rank 4): 35.25,0.25 0.25,0.25 0.25,86.75 35.25,86.75 35.25,27.5 29.75,27.5 29.75,16.25 32,16.25 32,25.5 33,25.5 33,16.25 35.25,16.25
  pour Top (rank 4): 35.25,0.25 0.25,0.25 0.25,86.75 35.25,86.75 35.25,27.5 29.75,27.5 29.75,16.25 32,16.25 32,25.5 33,25.5 33,16.25 35.25,16.25
IO2/CC3000_INT  (via drill 0.33)
  Top 0.178: U$3.18 20.25,49.73 v21.51,48.47
  Bottom 0.178: U$12.14 11.75,21.65 11.15,22.25 11.15,23.47 10.84,23.78 10.34,23.78 9.93,24.18 9.93,24.79 9.32,25.4 9.32,28.66 8.1,29.87 8.1,45.83 11.25,48.98 15.11,48.98 16.13,47.96 21,47.96 v21.51,48.47
IO4  (via drill 0.33)
  Top 0.178: U$3.74 12.25,68.57 13.28,69.6 13.28,74.27 13.59,74.58 18.06,74.58 v18.77,75.29
  Bottom 0.178: v18.77,75.29 18.77,79.11 CN8.10
IO5  (via drill 0.33)
  Top 0.178: U$3.76 9,64.25 8.75,64.5 8.75,66.95 9.93,68.13 9.93,71.02 11.15,72.24 11.15,75.6 v10,76.75
  Bottom 0.178: v10,76.75 CN7.14
IO6  (via drill 0.33)
  Top 0.178: U$3.77 8.75,63.75 8.25,64.25 8.25,67.1 9.53,68.38 9.53,71.23 10.75,72.45 10.75,74 v10,74.75
  Bottom 0.178: v10,74.75 CN7.12
IO7/RAD_SIG1  (via drill 0.33)
  Top 0.178: U$3.19 20.75,53.7 19.48,54.97 19.07,54.97 18.46,55.58 18.46,56.59 19.28,57.41 v19.28,61.06
  Bottom 0.178: v19.28,61.06 18.97,60.76 13.08,60.76 12.88,60.56 10.13,60.56 8.51,58.93 8.51,55.38 6.58,53.45 4.75,53.45 2.72,51.41 2.72,47.55 1.4,46.23 1.4,36.65 CN3.2
IO8  (via drill 0.33)
  Top 0.178: U$3.79 8.5,62.75 7.75,63.5 7.75,67.32 9.12,68.69 9.12,71.87 v10,72.75
  Bottom 0.178: v10,72.75 CN7.10
IO9/AUDIO  (via drill 0.33)
  Top 0.178: U$3.78 v11.75,63.25 | v6.27,62.89 6.17,62.79 3.02,62.79 1.7,61.47 1.7,49.08 2.75,48.03 CN3.6
  Bottom 0.178: v11.75,63.25 6.63,63.25 v6.27,62.89
IO22/OLED_REG
  Top 0.203: CN1.20 20.25,39.75 14.75,45.25 U$3.7
IO23/OLED_RESET
  Top 0.203: CN1.21 20.75,40 15.25,45.5 U$3.8
IO25  (via drill 0.33)
  Top 0.178: U$3.51 24.16,65.85 v24.66,66.35
  Bottom 0.178: v24.66,66.35 24.66,65.43 25.27,64.82 27.55,64.82 CN9.16
IO26  (via drill 0.33)
  Top 0.178: U$3.56 21.25,67 21.82,67.57 v24.66,67.57
  Bottom 0.178: v24.66,67.57 24.76,67.57 25.58,66.75 CN9.14
IO27  (via drill 0.33)
  Top 0.178: U$3.57 20.75,67.11 21.72,68.08 23.95,68.08 v24.66,68.79
  Bottom 0.178: v24.66,68.79 27.59,68.79 CN9.12
IO28/OLED_BOOST_EN  (via drill 0.33)
  Top 0.178: U$3.1 10.69,50.65 v9.93,49.89 | v25.07,46.74 25.37,47.04 29.03,47.04 29.54,46.54 29.54,33.12 28.72,32.31 v28.12,32.31
  Bottom 0.178: U$24.4 26.12,36.25 26.62,35.75 26.62,34.12 27.25,33.5 R14.2 28.12,33.47 v28.12,32.31 | v9.93,49.89 10.23,50.19 21.61,50.19 v25.07,46.74
IO45  (via drill 0.33)
  Top 0.178: U$3.87 11.15,58.75 v12.25,59.85
  Bottom 0.178: v12.25,59.85 11.6,59.85 10.75,59 CN6.16
IO46  (via drill 0.33)
  Top 0.178: U$3.88 12.15,58.25 v13,59.1
  Bottom 0.203: v13,59.1 13,57.85 CN6.14
IO47  (via drill 0.33)
  Top 0.178: U$3.83 11.25,60.75 12.4,61.9 12.4,63.5 9.49,66.41 9.49,67.05 10.33,67.88 10.33,70.71 11.55,71.94 11.55,76.2 7.75,80 v7.75,80.5
  Bottom 0.178: v7.75,80.5 7.75,78.88 CN7.16
IO48  (via drill 0.33)
  Top 0.178: U$3.68 15.25,67.83 14.09,68.99 14.09,73.46 14.4,73.77 22.22,73.77 v22.73,74.27
  Bottom 0.178: v22.73,74.27 22.75,74.29 CN8.14
IO70/CC3000_EN  (via drill 0.33)
  Top 0.178: U$3.17 19.78,50.62 19.78,49.58 20.7,48.67 20.7,48.16 21.11,47.76 22.93,47.76 24.66,46.03 25.37,46.03 25.98,46.64 28.42,46.64 29.13,45.93 29.13,34.55 27.2,32.62 v27.2,31.3
  Bottom 0.178: v27.2,31.3 27.16,31.25 R19.2 23.75,31.1 U$12.26
IO72  (via drill 0.33)
  Top 0.178: U$3.60 19.25,67.03 19.68,67.47 20.5,67.47 21.51,68.48 23.24,68.48 24.66,69.9 v24.66,70.72
  Bottom 0.178: v24.66,70.72 27.59,70.72 CN9.10
IO73  (via drill 0.33)
  Top 0.178: U$3.61 18.75,67.24 19.38,67.87 20.29,67.87 21.31,68.89 23.14,68.89 23.95,69.7 v23.95,73.36
  Bottom 0.178: v23.95,73.36 24.97,74.38 24.97,76 24.75,76.22 CN8.16
IO75  (via drill 0.33)
  Top 0.178: U$3.73 12.75,68.46 13.69,69.4 13.69,73.87 13.99,74.17 19.58,74.17 v20.7,75.29
  Bottom 0.178: v20.7,75.29 20.75,75.34 CN8.12
IO80  (via drill 0.33)
  Top 0.178: U$3.91 12.4,56.75 v14.75,59.1
  Bottom 0.178: v14.75,59.1 CN6.12
IO81  (via drill 0.33)
  Top 0.178: U$3.92 13.25,56.25 16.1,59.1 v16.75,59.1
  Bottom 0.178: v16.75,59.1 CN6.10
IO82/TOUCH_INT  (via drill 0.33)
  Top 0.178: U$3.95 7.48,54.75 7.29,54.56 5.76,54.56 5.36,54.16 v5.36,52.23 | v4.65,28.55 21.61,28.55 22.25,27.92 CN4.6
  Bottom 0.178: v5.36,52.23 5.36,51.21 6.17,50.4 6.17,48.26 5.26,47.35 5.26,29.16 v4.65,28.55
IO83/SD_CDET  (via drill 0.33)
  Top 0.178: U$3.96 7.69,54.25 7.49,54.05 6.78,54.05 6.07,53.34 v6.07,51.52 | v4.34,30.08 3.94,29.67 3.94,25.81 6.76,22.99 6.76,19.08 6.35,18.68 U$7.10 6.35,12.8 R10.2
  Bottom 0.178: v6.07,51.52 6.58,51.01 6.58,48.06 5.66,47.15 5.66,28.25 5.26,27.84 3.94,27.84 3.63,28.15 3.63,29.47 4.24,30.08 v4.34,30.08
IO84/CS_SD  (via drill 0.33)
  Top 0.178: U$3.97 7.9,53.75 v6.78,52.63 | U$7.2 14.62,23.35 14.09,23.88 14.09,27.03 13.79,27.33 9.12,27.33 8.2,26.42 v7.69,26.42
  Bottom 0.178: v6.78,52.63 6.78,51.52 6.98,51.31 6.98,47.86 6.07,46.94 6.07,27.54 6.48,27.13 7.49,27.13 7.69,26.93 v7.69,26.42
MCLR#  (via drill 0.33)
  Top 0.178: SJ1.2 31.26,6.51 30.76,7.01 30.76,9.55 29.23,11.08 29.23,13.72 25.53,17.43 25.53,20.83 28.67,23.98 28.67,30.48 29.84,31.65 33.3,31.65 34.01,32.36 34.01,35.72 33.6,36.12 32.77,36.12 R11.1 32.62,36.23 CN2.1 | U$3.13 17.75,49.48 17.65,49.38 17.65,44.2 v17.75,44.1
  Bottom 0.178: v17.75,44.1 18.06,43.79 30.45,43.79 31.37,42.88 31.37,40.95 32.62,39.69 CN2.1
N$1
  Bottom 0.203: U$2.4 4.25,25.75 arc-90 4.75,26.25 L3.1
N$2
  Bottom 0.203: U$2.2 3.25,25.75 arc90 2.75,26.25 L3.2
N$3
  Bottom 0.254: U$9.15 21.25,9.5 arc90 20.8,9.05 arc-90 20.29,8.54 18.97,8.54 arc90 18.56,8.13 arc90 18.97,7.73 19.89,7.73 arc-90 20.29,7.32 arc-90 19.89,6.91 18.87,6.91 arc90 18.4,6.44 U$8.2
N$4
  Bottom 0.254: U$8.3 17.75,3.87 arc90 18.26,3.36 20.7,3.36 arc90 21.31,3.97 21.31,8.34 arc-90 21.97,9 U$9.14
N$5  (via drill 0.33)
  Top 0.178: v27,12 23.75,8.75 R1.1
  Bottom 0.178: U$9.22 26.5,11.5 v27,12
N$6  (via drill 0.33)
  Top 0.178: R2.1 21.75,8.25 22.5,8.25 22.75,8.5 22.75,9.25 v25.6,12.1
  Bottom 0.178: U$9.21 26,11.7 v25.6,12.1
N$7
  Top 0.178: D4.CATHODE R1.2
N$8
  Top 0.178: D5.CATHODE R2.2
N$9  (via drill 0.33)
  Top 0.178: v29.25,5 C3.1
  Bottom 0.178: U$9.31 29,7 29.25,6.75 v29.25,5
N$10  (via drill 0.33)
  Top 0.178: v29.25,3 R3.1
  Bottom 0.178: v29.25,3 28.25,4 U$9.32
N$11
  Top 0.178: C3.2 26.4,4 | 26.4,4 R3.2 | SJ1.1 26.4,4
N$12  (via drill 0.33)
  Top 0.178: C4.1 R7.2 19.25,10.65 R6.1
  Top 0.203: v22.5,12 21.85,12.65 C4.1
  Bottom 0.178: U$9.18 24.5,11.5 24,12 v22.5,12
N$13  (via drill 0.33)
  Top 0.178: v25.25,4.25 25.25,8.75 25.5,9 R5.1
  Bottom 0.178: U$9.2 27,4.75 26.5,4.25 v25.25,4.25
N$14
  Bottom 0.635: L6.2 C31.1 U$6.1
N$15  (via drill 0.33)
  Top 0.178: v29.5,8 26.75,8 26.4,7.65 R4.1
  Bottom 0.178: U$9.30 29,7.5 v29.5,8
N$16
  Bottom 0.178: U$12.27 24.95,30.26 25.27,30.59 25.78,30.59 26.15,30.21 U$12.28
N$18
  Bottom 0.635: U$12.35 L6.1
N$19
  Top 0.178: U$3.85 C7.A
N$20  (via drill 0.33)
  Top 0.203: CN1.3 11.75,39.77 v13.28,41.3
  Bottom 0.203: v13.28,41.3 13.28,42.24 C15.1
N$21
  pour Bottom: 23.75,37.88 17.12,37.88 17.12,42.6 20.5,42.6 20.5,41.12 21.88,39.75 23.75,39.75
N$22
  Top 0.203: CN1.22 21.25,35.91 20.72,35.38 R15.2
N$23
  pour Bottom: 25.12,37.88 27.12,37.88 27.12,34.75 28.62,34.75 28.62,40.38 27.12,40.38 27.12,39.75 25.12,39.75
N$24
  Top 0.203: CN1.26 23.25,35.88 22.72,35.35 C16.1
N$25
  Bottom 0.203: D10.2 D9.1
N$26
  Bottom 0.203: D9.2 15.25,38.23 R18.1
N$27
  Bottom 0.305: U1.5 17.75,12.1 R12.2
N$28
  Bottom 0.203: U$12.30 arc-90 28.5,25.3 29.44,25.3 arc90 29.84,25.71 29.84,25.91 arc90 29.33,26.42 28.48,26.42 arc-90 U$12.29
N$29  (via drill 0.33)
  Top 0.203: CN1.5 12.75,38.89 v13.54,39.68
  Bottom 0.203: v13.54,39.68 13.54,38.46 R18.2
N$32  (via drill 0.33)
  Top 0.254: v17.45,7.32 15.07,7.32 13.75,6 D1.CATHODE
  Bottom 0.254: U1.1 17.7,7.57 v17.45,7.32
N$33
  Bottom 0.203: U$12.7 18.95,14.55 19.25,14.25 21,14.25 21.35,14.6 U$12.5
NCS1  (via drill 0.33)
  Top 0.178: CN1.19 19.75,35.29 19.83,35.21 19.83,32.23 19.25,31.64 16.22,31.64 14.5,29.92 7.85,29.92 4.39,33.38 4.39,47.09 2.11,49.38 2.11,61.27 3.02,62.18 7.08,62.18 v7.39,62.49 | v13.69,62.49 13.75,62.55 U$3.71
  Bottom 0.178: v7.39,62.49 v13.69,62.49
NRD
  Top 0.178: U$3.82 3.31,61.25 2.92,60.86 2.92,49.79 5.19,47.52 5.19,33.8 8.25,30.74 14.09,30.74 17.75,34.39 CN1.15
NWR
  Top 0.178: U$3.81 3.2,61.75 2.51,61.06 2.51,49.58 4.78,47.31 4.78,33.59 8.05,30.33 14.3,30.33 18.25,34.28 CN1.16
OSC1
  Top 0.178: U$3.63 17.75,69.5 arc-90 18.5,70.25 X1.1 arc-90 19.65,70.35
  Top 0.203: C5.1 20.35,70.85 X1.1
OSC2
  Top 0.178: U$3.64 17.25,69.5 arc90 16.5,70.25 X1.2 arc90 15.35,70.35
  Top 0.203: C6.1 15.25,72.75 X1.2
PGEC2  (via drill 0.33)
  Top 0.178: U$3.26 27.48,52.25 27.81,51.92 v28.62,51.92
  Bottom 0.178: v28.62,51.92 30.53,51.92 CN2.5
PGED2  (via drill 0.33)
  Top 0.178: U$3.27 v28,52.75
  Bottom 0.178: v28,52.75 32.25,52.75 34.25,50.75 34.25,48.66 CN2.4
RG0/RAD_SIG2  (via drill 0.33)
  Top 0.178: U$3.90 7.94,57.25 6.58,55.88 4.44,55.88 3.73,55.17 3.73,50.5 4.14,50.09 v4.65,50.09
  Bottom 0.178: v4.65,50.09 5.36,49.38 5.36,48.77 4.44,47.86 4.44,39.52 CN3.3
RG1/RAD_NS  (via drill 0.33)
  Top 0.178: U$3.89 7.83,57.75 6.37,56.29 4.24,56.29 3.33,55.38 3.33,50.19 4.44,49.08 v4.65,49.08
  Bottom 0.178: v4.65,49.08 4.04,48.47 4.04,41.66 CN3.4
SCL1  (via drill 0.33)
  Top 0.178: v31.5,68 34.25,70.75 34.25,84.5 33.25,85.5 23.75,85.5 v21.25,83 18.75,85.5 2.5,85.5 1.25,84.25 1.25,78 v4,75.25 | U$3.66 16.25,63.53 v16.23,63.5 16.23,62.08 18.46,59.85 18.46,57.92 17.45,56.9 17.45,54.87 17.04,54.46 v14.81,54.46 | v6.78,27.84 7.49,27.13 8.3,27.13 8.91,27.74 20.7,27.74 21.25,27.19 CN4.10
  Bottom 0.178: CN9.11 32.25,68.75 v31.5,68 | CN8.11 20.75,83.5 v21.25,83 | CN7.11 3.5,74.75 v4,75.25 4.45,75.7 10.44,75.7 10.95,75.19 10.95,74.07 16.23,68.79 v16.23,63.5 | v14.81,54.46 14.75,54.41 CN6.11 14.75,51.36 14.4,51.01 8.2,51.01 7.39,50.19 7.39,47.65 6.48,46.74 6.48,28.15 v6.78,27.84
SDA1  (via drill 0.33)
  Top 0.178: v31.5,71.25 33,71.25 33.75,72 33.75,84.25 33,85 25,85 21,81 19,81 18.25,81.75 v18.25,83 18.25,84.5 17.75,85 2.75,85 1.75,84 1.75,79 6,74.75 6,73 5.25,72.25 v4,72.25 | U$3.67 15.75,64.55 v15.31,64.11 15.31,62.39 18.06,59.64 18.06,58.22 16.74,56.9 v16.74,55.17 | v7.8,27.84 8.1,28.15 21.11,28.15 21.75,27.5 CN4.8
  Bottom 0.178: CN9.9 32,70.75 v31.5,71.25 | CN8.9 18.75,83.5 v18.25,83 | CN7.9 3.5,72.75 v4,72.25 4.52,71.73 12.67,71.73 15.82,68.58 15.82,64.42 15.52,64.11 v15.31,64.11 | v16.74,55.17 v16.75,55.16 CN6.9 16.75,50.92 16.43,50.6 8.51,50.6 7.8,49.89 7.8,47.45 6.88,46.54 6.88,28.96 7.8,28.15 v7.8,27.84
SPI2_CLK  (via drill 0.33)
  Top 0.178: v31.5,76.25 32.25,77 32.25,83 31.75,83.5 25.75,83.5 21.75,79.5 15.5,79.5 13.25,81.75 v13.25,83 12.75,83.5 3.75,83.5 3.25,83 3.25,79.75 7.5,75.5 7.5,69.5 5.25,67.25 v4,67.25 | U$3.70 14.25,67.52 v14.3,67.57
  Bottom 0.178: CN9.3 32,76.75 v31.5,76.25 | CN8.3 12.75,83.5 v13.25,83 | CN7.3 3.5,66.75 v4,67.25 5.37,67.25 5.87,66.75 5.87,66.04 6.17,65.74 10.23,65.74 11.25,66.75 13.48,66.75 v14.3,67.57 14.3,66.5 13.74,65.94 13.74,63.55 15.31,61.98 19.48,61.98 21.82,59.64 21.82,54.87 22.75,53.93 CN6.3
SPI2_MISO  (via drill 0.33)
  Top 0.178: v31.5,72.75 32.75,72.75 33.25,73.25 33.25,84 32.75,84.5 25.25,84.5 21.25,80.5 18,80.5 16.75,81.75 v16.75,83 16.75,84 16.25,84.5 3,84.5 2.25,83.75 2.25,79.25 6.5,75 6.5,72 5.25,70.75 v4,70.75 | U$3.9 15.75,52.26 17.91,54.41 v18.77,54.41 17.85,55.33 17.85,56.7 18.87,57.71 18.87,60.05 17.14,61.78 v17.14,63.1
  Bottom 0.178: CN9.7 v31.5,72.75 | CN8.7 v16.75,83 | CN7.7 v4,70.75 4.95,69.8 13.99,69.8 15.42,68.38 15.42,66.25 14.6,65.43 14.6,63.91 15.72,62.79 16.84,62.79 v17.14,63.1 | v18.77,54.41 18.77,52.92 CN6.7
SPI2_MOSI  (via drill 0.33)
  Top 0.178: v31.5,74.75 32.25,74.75 32.75,75.25 32.75,83.5 32.25,84 25.5,84 21.5,80 16.5,80 14.75,81.75 v14.75,83 14.75,83.75 14.5,84 3.25,84 2.75,83.5 2.75,79.5 7,75.25 7,70.5 5.25,68.75 v4,68.75 | U$3.72 13.25,67.84 v13.48,68.18
  Bottom 0.178: CN9.5 v31.5,74.75 | CN8.5 v14.75,83 | CN7.5 v4,68.75 4.98,67.77 13.08,67.77 v13.48,68.18 13.89,68.58 14.6,68.58 15.01,68.18 15.01,66.55 14.2,65.74 14.2,63.71 15.52,62.39 19.68,62.39 23.04,59.03 23.54,59.03 23.75,58.83 23.75,51.72 23.24,51.21 21.11,51.21 20.75,51.56 CN6.5
SPI_CLK  (via drill 0.33)
  Top 0.178: U$3.10 16.25,49.61 15.72,49.08 15.72,46.84 v16.13,46.44 | v11.05,26.52 10.34,26.52 10.03,26.22 10.03,21.04 11.02,20.05 U$7.5
  Bottom 0.178: v16.13,46.44 14.4,48.16 11.66,48.16 8.91,45.42 8.91,30.28 11.05,28.15 v11.05,26.52 11.05,25.81 11.61,25.25 U$12.17
SPI_MISO  (via drill 0.33)
  Top 0.178: U$3.11 16.75,48.89 v16.53,48.67
  Top 0.203: U$7.7 11.89,17.85 9.22,20.53 v9.22,24.39
  Bottom 0.178: v16.53,48.67 15.82,49.38 11.05,49.38 7.69,46.03 7.69,29.67 8.91,28.45 8.91,24.69 v9.22,24.39
  Bottom 0.203: v9.22,24.39 9.22,23.27 9.52,22.97 10.23,22.97 U$15.4
SPI_MOSI  (via drill 0.33)
  Top 0.178: U$3.12 17.25,47.66 v16.84,47.25 | v10.74,24.79 13.29,22.25 U$7.3
  Bottom 0.178: U$12.15 11.77,22.85 11.55,23.07 11.55,23.98 v10.74,24.79 9.73,25.81 9.73,28.86 8.51,30.08 8.51,45.62 11.45,48.57 14.91,48.57 16.23,47.25 v16.84,47.25
U1ARX  (via drill 0.33)
  Top 0.178: R4.2 30.03,7 30.25,7.22 30.25,9.45 28.83,10.88 28.83,13.57 25.12,17.28 25.12,20.98 28.27,24.13 28.27,30.69 30.4,32.82 30.4,47.15 31.25,48 31.25,50.5 34,53.25 34,61.46 v34.31,61.78 | U$3.52 23.25,64.23 22.53,63.5 22.53,63.1 v21.72,62.28
  Bottom 0.178: v34.31,61.78 34.11,61.78 33.5,62.39 30.35,62.39 29.94,61.98 24.86,61.98 24.15,61.27 22.73,61.27 v21.72,62.28
U1ATX  (via drill 0.33)
  Top 0.178: R5.2 28.1,13.68 24.71,17.07 24.71,21.19 27.86,24.34 27.86,30.84 30,32.98 30,47.38 30.88,48.25 30.88,50.75 33.62,53.5 33.62,62.31 v34.11,62.79 | v21.72,63.3 22.75,64.34 U$3.53
  Bottom 0.178: v34.11,62.79 30.05,62.79 29.74,62.49 24.76,62.49 23.95,61.67 22.93,61.67 22.43,62.18 22.43,62.59 v21.72,63.3
U1BRX  (via drill 0.33)
  Top 0.178: U$3.47 23.55,62.75 v23.3,62.5
  Bottom 0.178: v23.3,62.5 24,62.5 24.5,63 29.5,63 31.25,64.75 CN9.15
U1BTX  (via drill 0.33)
  Top 0.178: U$3.48 23.75,63.25 v23.5,63.5
  Bottom 0.178: v23.5,63.5 29.25,63.5 30.75,65 30.75,66 31.5,66.75 CN9.13
U3ARX  (via drill 0.33)
  Top 0.178: U$3.49 26.53,63.75 27.3,64.52 27.3,65.13 25.88,66.55 25.88,73.46 v24.25,75.09
  Bottom 0.178: v24.25,75.09 23.75,75.59 23.75,82.5 24.75,83.51 CN8.15
U3ATX  (via drill 0.33)
  Top 0.178: U$3.50 25.44,64.25 25.47,64.22 25.47,72.85 23.24,75.09 v21.72,75.09
  Bottom 0.178: v21.72,75.09 21.72,82.1 22.73,83.11 22.73,85.36 CN8.13
U3BRX  (via drill 0.33)
  Top 0.178: U$3.40 21.19,59.25 v21,59.44
  Bottom 0.178: v21,59.44 20.19,60.25 14.7,60.25 13.79,59.34 13.79,56.49 12.47,55.17 11.35,55.17 10.74,54.56 CN6.15
U3BTX  (via drill 0.33)
  Top 0.178: U$3.39 20.68,58.75 v19.99,59.44
  Bottom 0.178: v19.99,59.44 19.63,59.8 16.18,59.8 15.72,59.34 15.72,55.98 15.11,55.38 14.09,55.38 12.75,54.03 CN6.13
VBAT
  pour Bottom: 16.03,10.52 16.03,8.33 15.21,8.33 14.91,8.03 14.81,8.03 14.81,6.2 13.18,4.58 9.12,4.58 7.69,6 4.95,6 4.75,5.79 4.75,0.92 4.54,0.71 3.02,0.71 2.82,0.92 2.82,6.3 3.53,7.01 8.1,7.01 9.01,6.1 13.18,6.1 13.18,8.84 14.86,10.52
VIN  (via drill 0.33)
  Top 0.178: v31.51,9.66 31.51,7.17 32.03,6.65 32.03,3.13 30.72,1.82 12.02,1.82 11.25,2.58
  Top 0.203: 11.25,2.58 v11.25,10
  Top 0.254: CN4.3 22.75,18.25 21,16.5 19.5,16.5 17.5,14.5 15.25,14.5 13.5,16.25 10,16.25 8.5,14.75 v8.5,13.5
  Top 0.508: v5.56,22.05 3.33,24.29 3.33,30.59 3.94,31.2 4.95,31.2 6.88,29.26 15.52,29.26 16.03,29.77 16.93,29.77 C30.2 17.12,30.66 v17.14,30.84
  Bottom 0.178: 4.85,21.75 5.16,21.75 v5.56,22.05
  Bottom 0.203: v11.25,10 D2.CATHODE | U$2.7 4.25,16.75 4.5,16.5 5.75,16.5 6.25,17 6.25,19 6.75,19.5 6.75,21.25 6.25,21.75 | 4.85,21.75 U$2.5
  Bottom 0.254: U$5.P 31.5,9.64 v31.51,9.66 | v8.5,13.5 8.5,13 9.25,12.25 D2.CATHODE
  Bottom 0.305: 15.31,28.64 U$12.19
  Bottom 0.508: L1.2 19.25,34.37 19.28,34.34 18.16,34.34 17.75,33.94 17.75,31.45 v17.14,30.84 15.97,30.84 15.31,30.18 15.31,28.64
  pour Bottom: 23.88,33.25 23.88,37.12 17.12,37.12 17.12,33.25
  pour Bottom: 3.75,19.12 3.75,15.88 5.75,13.88 6.88,13.88 7,13.75 9.38,11.5 9.38,6.62 12.5,6.62 12.5,13.88 12.12,13.88 9.23,16.36 9.22,17.09 8.26,17.06 6.98,18.49 7,20.5 7,22.12 6.38,22.75 4.62,22.75 4.62,21.38 6,21.38 6.25,21.12 6.25,19.38 6,19.12

### Text on the board
bPlace: Arducorder | Mini | rev0 | OSH | make | share | dream | give